# Altium project PCB_Test_Stand_Pergam_v1.PrjPcb
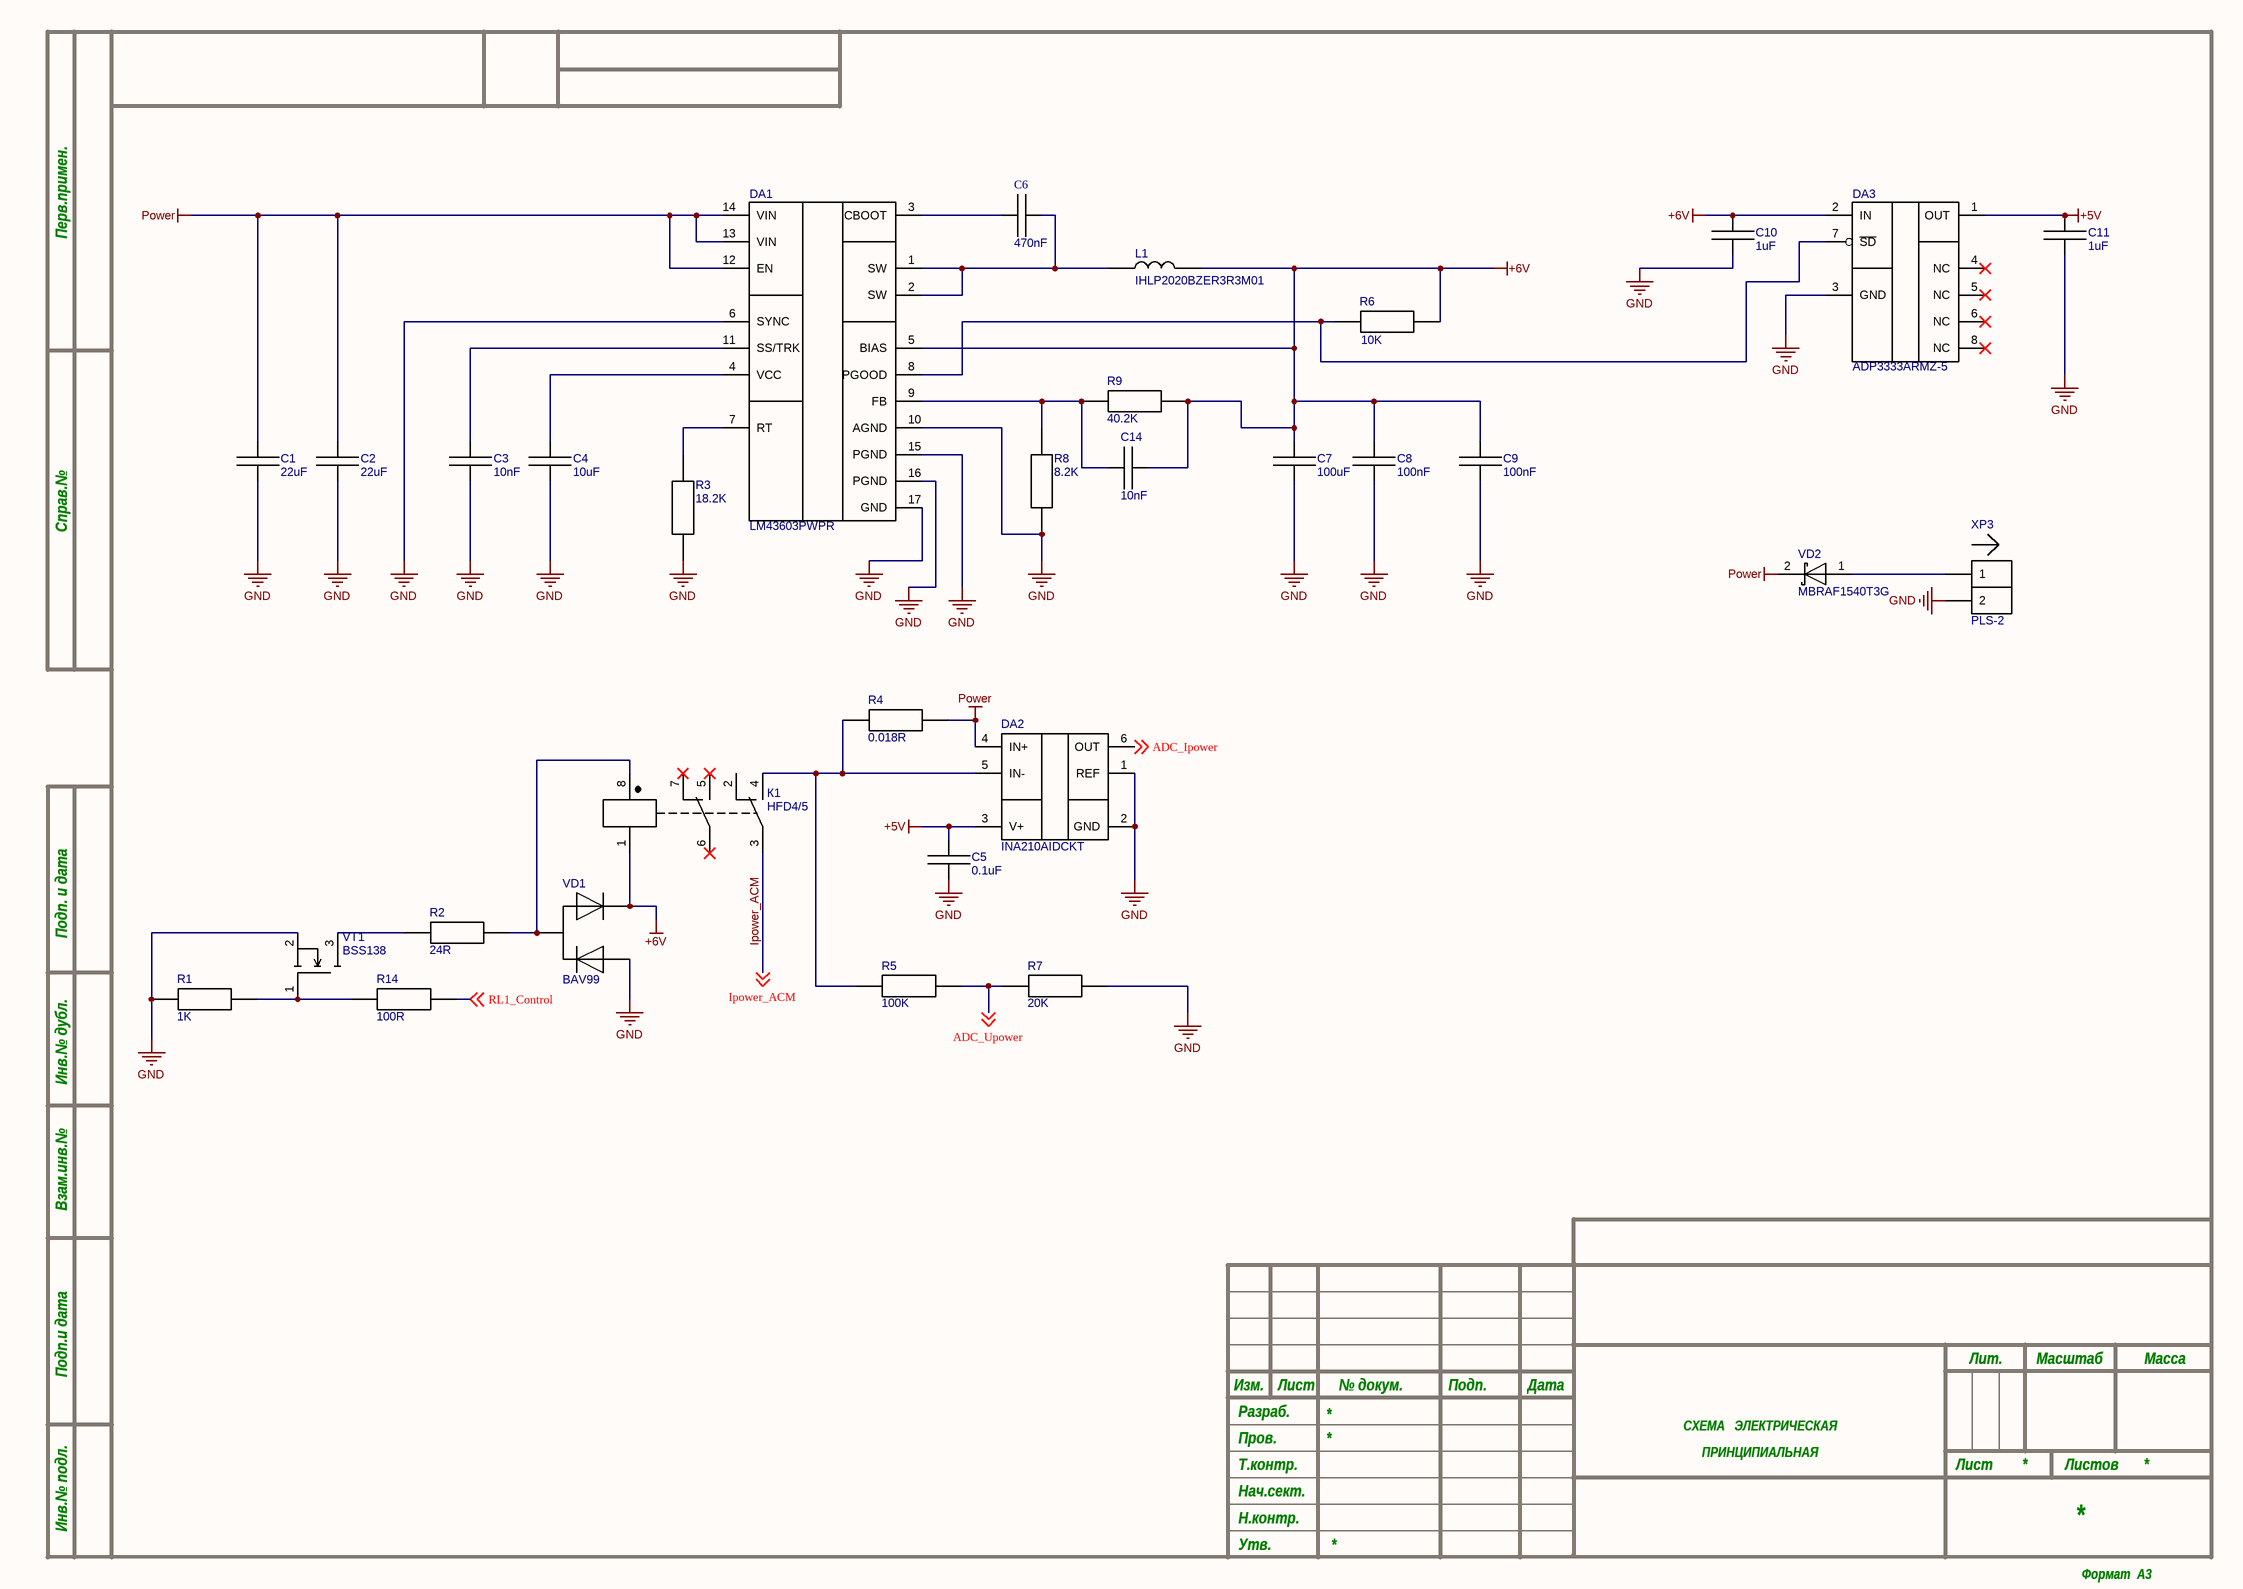
[diagram p0: Power.SchDoc]
8 sheets, 208 parts. Net scope: global (net labels, ports and power ports of the same name join across sheets).
Board file: test_stand.PcbDoc
Sheets:
  Power.SchDoc
  ControlPoint.SchDoc
  Rele.SchDoc
  STM.SchDoc
  Connectors.SchDoc
  Check_Laser.SchDoc
  Peltie.SchDoc
  MUX.SchDoc

## Sheet Power.SchDoc
size 420 x 297 mm

### Parts
C1  22uF  [1210C]
C2  22uF  [1210C]
C3  10nF  [0402C]
C4  10uF  [0402C]
C5  0.1uF  [0603C]
C6  470nF  [0402C]
C7  100uF  [1210C]
C8  100nF  [0402C]
C9  100nF  [0402C]
C10  1uF  [0603C]
C11  1uF  [0603C]
C14  10nF  [0402C]
DA1  LM43603PWPR  [TSSOP-17]
DA2  INA210AIDCKT  [SC-70-6]
DA3  ADP3333ARMZ-5  [MSOP-8]
L1  IHLP2020BZER3R3M01  [IHLP2020CZ-01]
R1  1K  [R0402]
R2  24R  [R0402]
R3  18.2K  [R0402]
R4  0.018R  [R1206]
R5  100K  [R0402]
R6  10K  [R0402]
R7  20K  [R0402]
R8  8.2K  [R0402]
R9  40.2K  [R0402]
R14  100R  [R0402]
VD1  BAV99  [SOT-23-3]
VD2  MBRAF1540T3G  [SMA-FL]
VT1  BSS138  [SOT-23-3]
XP3  PLS-2  [PLS-2]
К1  HFD4/5  [DIP-8]

### Nets
+5V: C5.2 C11.2 DA2.3(V+) DA3.1(OUT)
+6V: C7.2 C8.2 C9.2 C10.2 C14.2 DA1.5(BIAS) DA3.2(IN) L1.2 R6.2 R9.2 VD1.2 К1.1
GND: C1.1 C2.1 C3.1 C4.1 C5.1 C7.1 C8.1 C9.1 C10.1 C11.1 DA1.6(SYNC) DA1.10(AGND) DA1.15(PGND) DA1.16(PGND) DA1.17(GND) DA2.1(REF) DA2.2(GND) DA3.3(GND) R1.1 R3.1 R7.2 R8.1 VD1.1 VT1.2 XP3.2
Power: C1.2 C2.2 DA1.12(EN) DA1.13(VIN) DA1.14(VIN) DA2.4(IN+) R4.1 VD2.2
ADC_Ipower: DA2.6(OUT) ; off-sheet ADC_Ipower
ADC_Upower: R5.2 R7.1 ; off-sheet ADC_Upower
Ipower_ACM: К1.3 ; off-sheet Ipower_ACM
RL1_Control: R14.2 ; off-sheet RL1_Control
NetC3_2: C3.2 DA1.11(SS/TRK)
NetC4_2: C4.2 DA1.4(VCC)
NetC6_1: C6.1 DA1.3(CBOOT)
NetC6_2: C6.2 DA1.1(SW) DA1.2(SW) L1.1
NetC14_1: C14.1 DA1.9(FB) R8.2 R9.1
NetDA1_7: DA1.7(RT) R3.2
NetDA1_8: DA1.8(PGOOD) DA3.7(~{SD}) R6.1
NetDA2_5: DA2.5(IN-) R4.2 R5.1 К1.4
NetR1_2: R1.2 R14.1 VT1.1
NetR2_1: R2.1 VT1.3
NetR2_2: R2.2 VD1.3 К1.8
NetVD2_1: VD2.1 XP3.1

Not connected (* = marked no-connect by the designer): DA3 4(NC)* 5(NC)* 6(NC)* 8(NC)*; К1 2 5* 6* 7*

### Notes on the sheet
- Перв.примен.
- Справ.№
- Подп. и дата
- Инв.№ дубл.
- Взам.инв.№
- Подп.и дата
- Разраб.
- Изм.
- Лист
- № докум.
- Подп.
- Дата
- Лит.
- Масштаб
- Масса
- Т.контр.
- Пров.
- СХЕМА   ЭЛЕКТРИЧЕСКАЯ
- ПРИНЦИПИАЛЬНАЯ
- Листов
- Инв.№ подл.
- Утв.
- Н.контр.
- Нач.сект.
- Формат  A3

### Library data of the parts
C1 C2 = C1210-22uF 10% 50V: Part Number: SMD CAP CER 22uF ±10% 50V X7R 1210; Solder_Amount: 2; Pkg: 1210; MountType: SMD; Mount: MOUNT
C3 C14 = C0402-10nF 10% 50V: Part Number: SMD CAP CER 10nF ±10% 50V X5R 0402; Added_by: Rutel@Mail.ru; Solder_Amount: 2; Pkg: 0402; Created_at: 27/03/2020; MountType: SMD; Mount: MOUNT
C4 = C0402-10UF 10% 10V: Part Number: SMD CAP CER 10UF ±10% 10V X5R 0402; Added_by: Rutel@Mail.ru; Solder_Amount: 2; Pkg: 0402; Created_at: 27/03/2020; MountType: SMD; Mount: MOUNT
C5 = C0603-0.1UF 10% 50V: C0603 0.1UF 10% 50V; Part Number: SMD CAP CER 0.1UF ±10% 50V X7R 0603; Added_by: anton@teslatec.ru; Solder_Amount: 2; Pkg: 0603; Created_at: 10/01/2023; MountType: SMD; Mount: MOUNT
C6 = C0402-470nF 10% 50V: Part Number: SMD CAP CER 470nF ±10% 50V X5R 0402; Solder_Amount: 2; Pkg: 0402; MountType: SMD; Mount: MOUNT
C7 = C1210-100UF 10% 16V: Part Number: SMD CAP CER 100UF ±10% 16V X7R 1210; Solder_Amount: 2; Pkg: 1210; MountType: SMD; Mount: MOUNT
C8 C9 = C0402-100nF 10% 50V: Part Number: SMD CAP CER 100nF ±10% 50V X5R 0402; Added_by: Rutel@Mail.ru; Solder_Amount: 2; Pkg: 0402; Created_at: 27/03/2020; MountType: SMD; Mount: MOUNT
C10 C11 = C0603-1uF 10% 50V: Part Number: SMD CAP CER 1uF ±10% 50V X7R 0603; Added_by: grebelny_av@teslatec.ru; Solder_Amount: 2; Pkg: 0603; Created_at: 22/06/2021; MountType: SMD; Mount: MOUNT
DA1 = LM43603PWPR: LM43603PWPR 3.5-V to 36-V, 3-A Synchronous Step-Down Voltage Converter; Added_by: irdolgopolowa@yandex.ru; Pkg: MSE 16; Solder_Amount: 17; Value: LM43603QWPR; Created_at: 29/10/24; Mount: MOUNT; MountType: SMD; Part Number: LM43603PWPR
DA2 = INA210AIDCKT: 26V, 14kHz, bi-directional, package SC70-6, -40 to 125; Added_by: ridel_av@teslatec.ru; Solder_Amount: 6; Created_at: 02/02/2022; Mount: MOUNT; MountType: SMD; Part Number: INA210AIDCKT; Pkg: SC70-6
DA3 = ADP3333ARMZ-5: 5V 300 mA, Low Dropout, / CMOS Linear Regulator; Added_by: irdolgopolowa@yandex.ru; Pkg: 8-Lead MSOP; Solder_Amount: 8; Created_at: 29/10/24; Mount: MOUNT; MountType: SMD; Part Number: ADP3333ARMZ-5
L1 = IHLP2020BZER3R3M01: FIXED IND 3.3UH 3.3A 79 MOHM SMD; Solder_Amount: 2; Pkg: IHLP-2020BZ-01; Added_by: Rutel@teslatec.ru; Part Number: IHLP2020BZER3R3M01; MountType: SMD; Mount: MOUNT; Created_at: 14/05/2020
R1 = R0402-1K: Resistor SMD 1K 1% 0402; Part Number: SMD RES 1 KOHM 1% ±100ppm/°C 0402; Added_by: irdolgopolowa@yandex.ru; Solder_Amount: 2; Pkg: 0402; Created_at: 29/10/24; MountType: SMD; Mount: MOUNT
R2 = R0402-24R: Resistor SMD 24R 1% 0402; Part Number: SMD RES 24R OHM 1% ±100ppm/°C 0402; Added_by: Rutel@teslatec.ru; Solder_Amount: 2; Pkg: 0402; Created_at: 21/04/2020; MountType: SMD; Mount: MOUNT
R3 = R0402-18.2K: Resistor SMD 18.2K 1% 0402; Part Number: SMD RES 18.2 KOHM 1% ±100ppm/°C 0402; Added_by: Rutel@teslatec.ru; Solder_Amount: 2; Pkg: 0402; Created_at: 21/04/2020; MountType: SMD; Mount: MOUNT
R4 = R1206-0.018R: Resistor SMD 0.018R 1% 1206; Part Number: TL2BR018F SMD RES 0.018 OHM 1% ±75ppm/°C 1206; Added_by: irdolgopolowa@yandex.ru; Solder_Amount: 2; Pkg: 1206; Created_at: 07/11/2024; MountType: SMD; Mount: MOUNT
R5 = R0402-100K: Resistor SMD 100K 1% 0402; Part Number: SMD RES 100 KOHM 1% ±100ppm/°C 0402; Added_by: Rutel@teslatec.ru; Solder_Amount: 2; Pkg: 0402; Created_at: 21/04/2020; MountType: SMD; Mount: MOUNT
R6 = R0402-10K: Resistor SMD 10K 1% 0402; Part Number: SMD RES 10 KOHM 1% ±100ppm/°C 0402; Added_by: Rutel@teslatec.ru; Solder_Amount: 2; Pkg: 0402; Created_at: 21/04/2020; MountType: SMD; Mount: MOUNT
R7 = R0402-20K: Resistor SMD 20K 1% 0402; Part Number: SMD RES 20 KOHM 1% ±100ppm/°C 0402; Added_by: Rutel@teslatec.ru; Solder_Amount: 2; Pkg: 0402; Created_at: 21/04/2020; MountType: SMD; Mount: MOUNT
R8 = R0402-8.2K: Resistor SMD 8.2K 1% 0402; Part Number: SMD RES 8.2 KOHM 1% ±100ppm/°C 0402; Added_by: Rutel@teslatec.ru; Solder_Amount: 2; Pkg: 0402; Created_at: 21/04/2020; MountType: SMD; Mount: MOUNT
R9 = R0402-40.2K: Resistor SMD 40.2K 1% 0402; Part Number: SMD RES 40.2K KOHM 1% ±100ppm/°C 0402; Added_by: ridel_av@teslatec.ru; Solder_Amount: 2; Pkg: 0402; Created_at: 15/12/2021; MountType: SMD; Mount: MOUNT
R14 = R0402-100R: Resistor SMD 100R 1% 0402; Part Number: SMD RES 100 OHM 1% ±100ppm/°C 0402; Added_by: irdolgopolowa@yandex.ru; Solder_Amount: 2; Pkg: 0402; Created_at: 29/10/24; MountType: SMD; Mount: MOUNT
VD1 = BAV99: BAV99, UMW, 70В, 200мА; Added_by: andrew@teslatec.ru; Solder_Amount: 3; Created_at: 29/06/2020; Mount: MOUNT; MountType: SMD; Pkg: SOT-23-3; Part Number: BAV99
VD2 = MBRAF1540T3G: 1.5 A, 40 V Schottky Rectifier; Added_by: irdolgopolowa@yandex.ru; Solder_Amount: 2; Created_at: 29.10.24; Mount: MOUNT; MountType: SMD; Pkg: SMA-FL; Part Number: MBRAF1540T3G
VT1 = BSS138: N-Channel Logic Level Enhancement Mode Field Effect Transistor; Solder_Amount: 3; Added_by: ma_lubushkin@teslatec.ru; Pkg: SOT-23; Part Number: BSS138; Mount: MOUNT; MountType: SMD; Created_at: 03/12/2019
XP3 = PLS-2: HEADER 2.54mm; Added_by: irdolgopolowa@yandex.ru; Solder_Amount: 2; Created_at: 29/10/24; Mount: MOUNT; MountType: THM; Part Number: PLS-2; Pkg: PLS-2
К1 = HFD4/5: HFD4/5 (IM03TS) (1-1462037-8), 5VDC, 2A/250VAC DPDT; Part Number: HFD4/5SR; Added_by: irdolgopolowa@yandex.ru; Solder_Amount: 8; Created_at: 30/10/24; Mount: MOUNT; MountType: THM; Pkg: DIP-8

## Sheet ControlPoint.SchDoc
size 420 x 297 mm
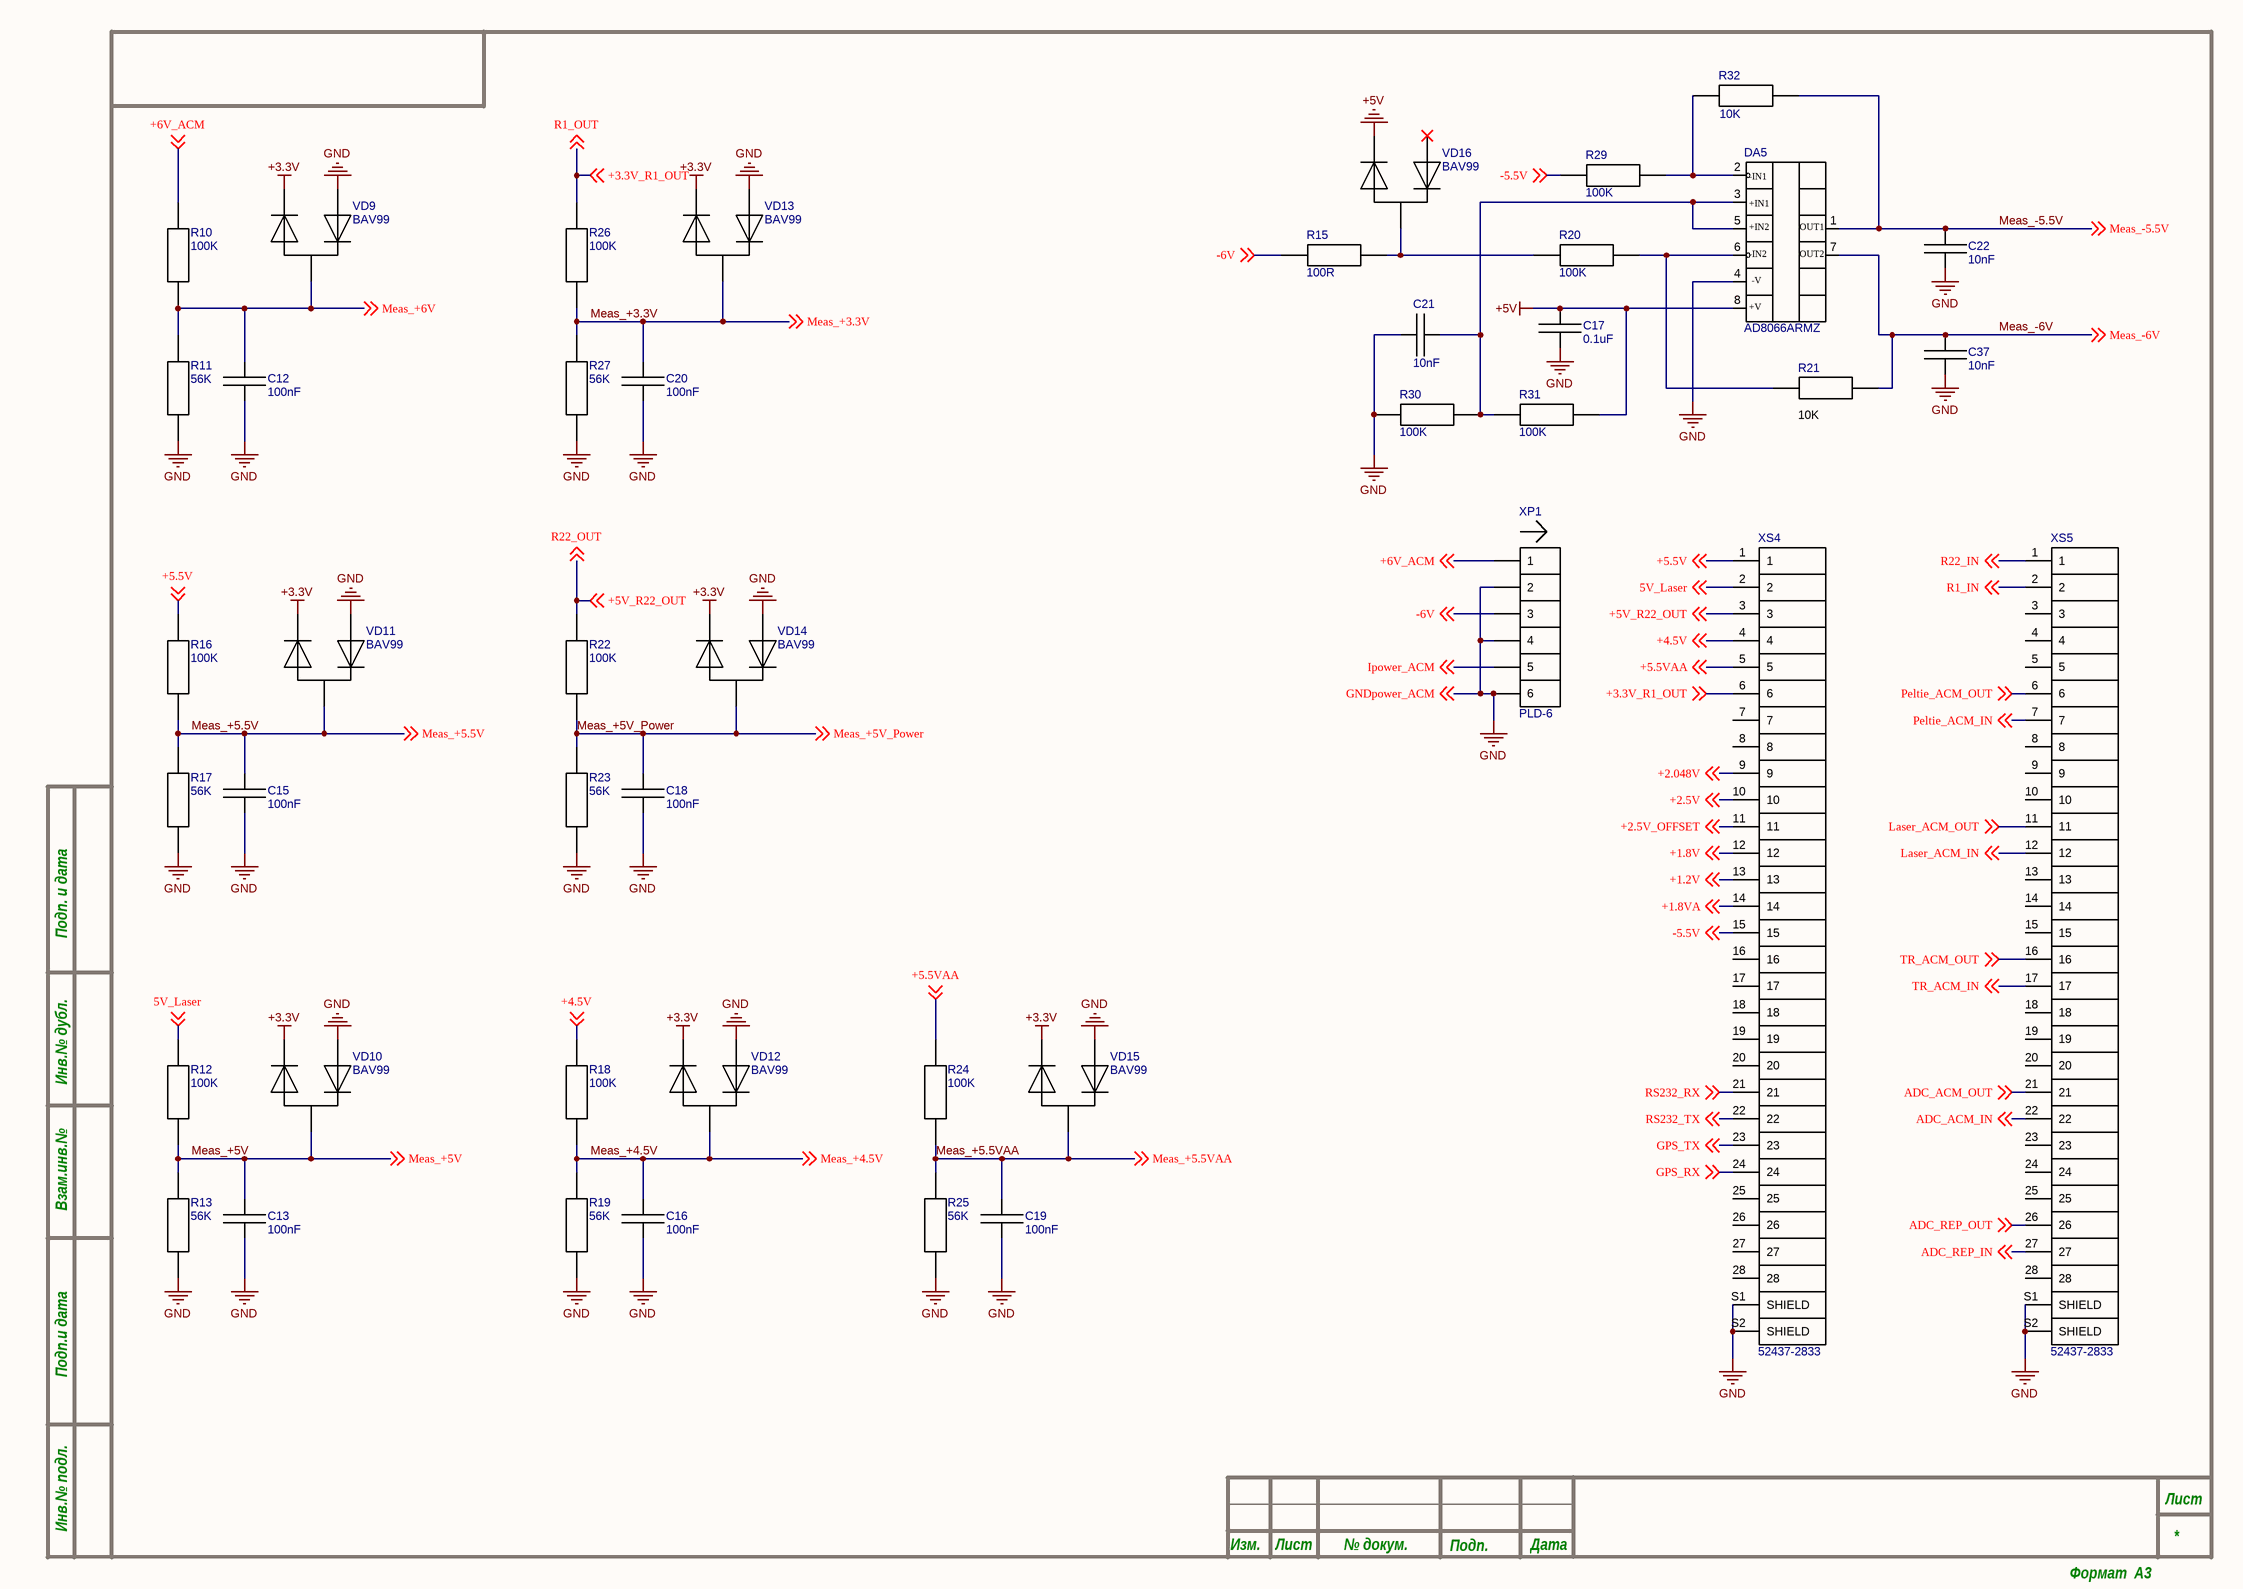
[diagram p1: ControlPoint.SchDoc]

### Parts
C12  100nF  [0402C]
C13  100nF  [0402C]
C15  100nF  [0402C]
C16  100nF  [0402C]
C17  0.1uF  [0603C]
C18  100nF  [0402C]
C19  100nF  [0402C]
C20  100nF  [0402C]
C21  10nF  [0402C]
C22  10nF  [0402C]
C37  10nF  [0402C]
DA5  AD8066ARMZ  [MSOP-8]
R10  100K  [R0402]
R11  56K  [R0402]
R12  100K  [R0402]
R13  56K  [R0402]
R15  100R  [R0402]
R16  100K  [R0402]
R17  56K  [R0402]
R18  100K  [R0402]
R19  56K  [R0402]
R20  100K  [R0402]
R21  10K  [R0402]
R22  100K  [R0402]
R23  56K  [R0402]
R24  100K  [R0402]
R25  56K  [R0402]
R26  100K  [R0402]
R27  56K  [R0402]
R29  100K  [R0402]
R30  100K  [R0402]
R31  100K  [R0402]
R32  10K  [R0402]
VD9  BAV99  [SOT-23-3]
VD10  BAV99  [SOT-23-3]
VD11  BAV99  [SOT-23-3]
VD12  BAV99  [SOT-23-3]
VD13  BAV99  [SOT-23-3]
VD14  BAV99  [SOT-23-3]
VD15  BAV99  [SOT-23-3]
VD16  BAV99  [SOT-23-3]
XP1  PLD-6  [PLD-6]
XS4  52437-2833  [MOLEX_52437-2833]
XS5  52437-2833  [MOLEX_52437-2833]

### Nets
+3.3V: VD9.2 VD10.2 VD11.2 VD12.2 VD13.2 VD14.2 VD15.2
+5V: C17.1 DA5.8(+VS) R31.2 VD16.2
GND: C12.1 C13.1 C15.1 C16.1 C17.2 C18.1 C19.1 C20.1 C21.1 C22.1 C37.1 DA5.4(-VS) R11.2 R13.2 R17.2 R19.2 R23.2 R25.2 R27.2 R30.1 VD9.1 VD10.1 VD11.1 VD12.1 VD13.1 VD14.1 VD15.1 XP1.2 XP1.4 XP1.6 XS4.S1(SHIELD) XS4.S2(SHIELD) XS5.S1(SHIELD) XS5.S2(SHIELD) ; off-sheet GNDpower_ACM  [also labelled GNDpower_ACM]
5V_Laser: R12.1 XS4.2 ; off-sheet 5V_Laser
+1.2V: XS4.13 ; off-sheet +1.2V
+1.8V: XS4.12 ; off-sheet +1.8V
+1.8VA: XS4.14 ; off-sheet +1.8VA
+2.5V: XS4.10 ; off-sheet +2.5V
+2.5V_OFFSET: XS4.11 ; off-sheet +2.5V_OFFSET
+2.048V: XS4.9 ; off-sheet +2.048V
+4.5V: R18.1 XS4.4 ; off-sheet +4.5V
+5.5V: R16.1 XS4.1 ; off-sheet +5.5V
+5.5VAA: R24.1 XS4.5 ; off-sheet +5.5VAA
+6V_ACM: R10.1 XP1.1 ; off-sheet +6V_ACM
-5.5V: R29.1 XS4.15 ; off-sheet -5.5V
-6V: R15.1 XP1.3 ; off-sheet -6V
ADC_ACM_IN: XS5.22 ; off-sheet ADC_ACM_IN
ADC_ACM_OUT: XS5.21 ; off-sheet ADC_ACM_OUT
ADC_REP_IN: XS5.27 ; off-sheet ADC_REP_IN
ADC_REP_OUT: XS5.26 ; off-sheet ADC_REP_OUT
GPS_RX: XS4.24 ; off-sheet GPS_RX
GPS_TX: XS4.23 ; off-sheet GPS_TX
Ipower_ACM: XP1.5 ; off-sheet Ipower_ACM
Laser_ACM_IN: XS5.12 ; off-sheet Laser_ACM_IN
Laser_ACM_OUT: XS5.11 ; off-sheet Laser_ACM_OUT
Meas_+3.3V: C20.2 R26.2 R27.1 VD13.3 ; off-sheet Meas_+3.3V
Meas_+4.5V: C16.2 R18.2 R19.1 VD12.3 ; off-sheet Meas_+4.5V
Meas_+5.5V: C15.2 R16.2 R17.1 VD11.3 ; off-sheet Meas_+5.5V
Meas_+5.5VAA: C19.2 R24.2 R25.1 VD15.3 ; off-sheet Meas_+5.5VAA
Meas_+5V: C13.2 R12.2 R13.1 VD10.3 ; off-sheet Meas_+5V
Meas_+5V_Power: C18.2 R22.2 R23.1 VD14.3 ; off-sheet Meas_+5V_Power
Meas_+6V: C12.2 R10.2 R11.1 VD9.3 ; off-sheet Meas_+6V
Meas_-5.5V: C22.2 DA5.1(VOUT) R32.2 ; off-sheet Meas_-5.5V
Meas_-6V: C37.2 DA5.7(VOUT2) R21.2 ; off-sheet Meas_-6V
Peltie_ACM_IN: XS5.7 ; off-sheet Peltie_ACM_IN
Peltie_ACM_OUT: XS5.6 ; off-sheet Peltie_ACM_OUT
R1_IN: XS5.2 ; off-sheet R1_IN
R1_OUT: R26.1 XS4.6 ; off-sheet R1_OUT, off-sheet +3.3V_R1_OUT  [also labelled +3.3V_R1_OUT]
R22_IN: XS5.1 ; off-sheet R22_IN
R22_OUT: R22.1 XS4.3 ; off-sheet R22_OUT, off-sheet +5V_R22_OUT  [also labelled +5V_R22_OUT]
RS232_RX: XS4.21 ; off-sheet RS232_RX
RS232_TX: XS4.22 ; off-sheet RS232_TX
TR_ACM_IN: XS5.17 ; off-sheet TR_ACM_IN
TR_ACM_OUT: XS5.16 ; off-sheet TR_ACM_OUT
NetC21_2: C21.2 DA5.3(+IN1) DA5.5(+IN2) R30.2 R31.1
NetDA5_2: DA5.2(-IN1) R29.2 R32.1
NetDA5_6: DA5.6(-IN2) R20.2 R21.1
NetR15_2: R15.2 R20.1 VD16.3

Not connected (* = marked no-connect by the designer): VD16 1*; XS4 7 8 16 17 18 19 20 25 26 27 28; XS5 3 4 5 8 9 10 13 14 15 18 19 20 23 24 25 28

### Notes on the sheet
- Подп. и дата
- Инв.№ дубл.
- Взам.инв.№
- Подп.и дата
- Инв.№ подл.
- Изм.
- Лист
- № докум.
- Подп.
- Дата
- Формат  A3
- (in symbol AD8066ARMZ) OUT1; OUT2; -V; +V

### Library data of the parts
C12 C13 C15 C16 C18-C20 = C0402-100nF 10% 50V: as C8 on sheet Power; Created_at: 27/03/2020; MountType: SMD; Mount: MOUNT
C17 = C0603-0.1UF 10% 50V: as C5 on sheet Power; Created_at: 10/01/2023; MountType: SMD; Mount: MOUNT
C21 C22 C37 = C0402-10nF 10% 50V: as C3 on sheet Power; Created_at: 27/03/2020; MountType: SMD; Mount: MOUNT
DA5 = AD8066ARMZ: High Performance, 145 MHz FastFET Op Amps; Added_by: irdolgopolowa@yandex.ru; Solder_Amount: 8; Created_at: 29/10/24; Mount: MOUNT; MountType: SMD; Pkg: MSOP-8; Part Number: AD8066ARMZ
R10 R12 R16 R18 R20 R22 R24 R26 R29-R31 = R0402-100K: as R5 on sheet Power; Created_at: 21/04/2020; MountType: SMD; Mount: MOUNT
R11 R13 R17 R19 R23 R25 R27 = R0402-56K: Resistor SMD 56K 1% 0402; Part Number: SMD RES 56K KOHM 1% ±100ppm/°C 0402; Added_by: ridel_av@teslatec.ru; Solder_Amount: 2; Pkg: 0402; Created_at: 15/12/2021; MountType: SMD; Mount: MOUNT
R15 = R0402-100R: as R14 on sheet Power; Created_at: 29/10/24; MountType: SMD; Mount: MOUNT
R21 R32 = R0402-10K: as R6 on sheet Power; Created_at: 21/04/2020; MountType: SMD; Mount: MOUNT
VD9-VD16 = BAV99: as VD1 on sheet Power; Created_at: 29/06/2020; Mount: MOUNT; MountType: SMD; Pkg: SOT-23-3; Part Number: BAV99
XP1 = PLD-6: Pin Header Pitch 2.54mm; Part Number: PLD-6 (DS1021-2x3); Pkg: PLD-6 2.54mm; Solder_Amount: 6; Added_by: ponomarev_ke@teslatec.ru; MountType: THM; Mount: MOUNT; Mating Part: *; Mating Terminals: *; Cable/Wire: *; Created_at: 21/05/2019
XS4 XS5 = 52437-2833: 28 Position FFC, FPC Connector Contacts, Bottom 0.020 _0.50mm_ Surface Mount, Right Angle; Part Number: 52437-2833 (MOLEX); Mating Part: FFCA 28pin, 0.5mm pitch, AVM 20624 80C 60V VW-1; Solder_Amount: 30; Added_by: ridel_av@teslatec.ru; Mount: MOUNT; MountType: SMD; Pkg: 52437-2833

## Sheet Rele.SchDoc
size 420 x 297 mm
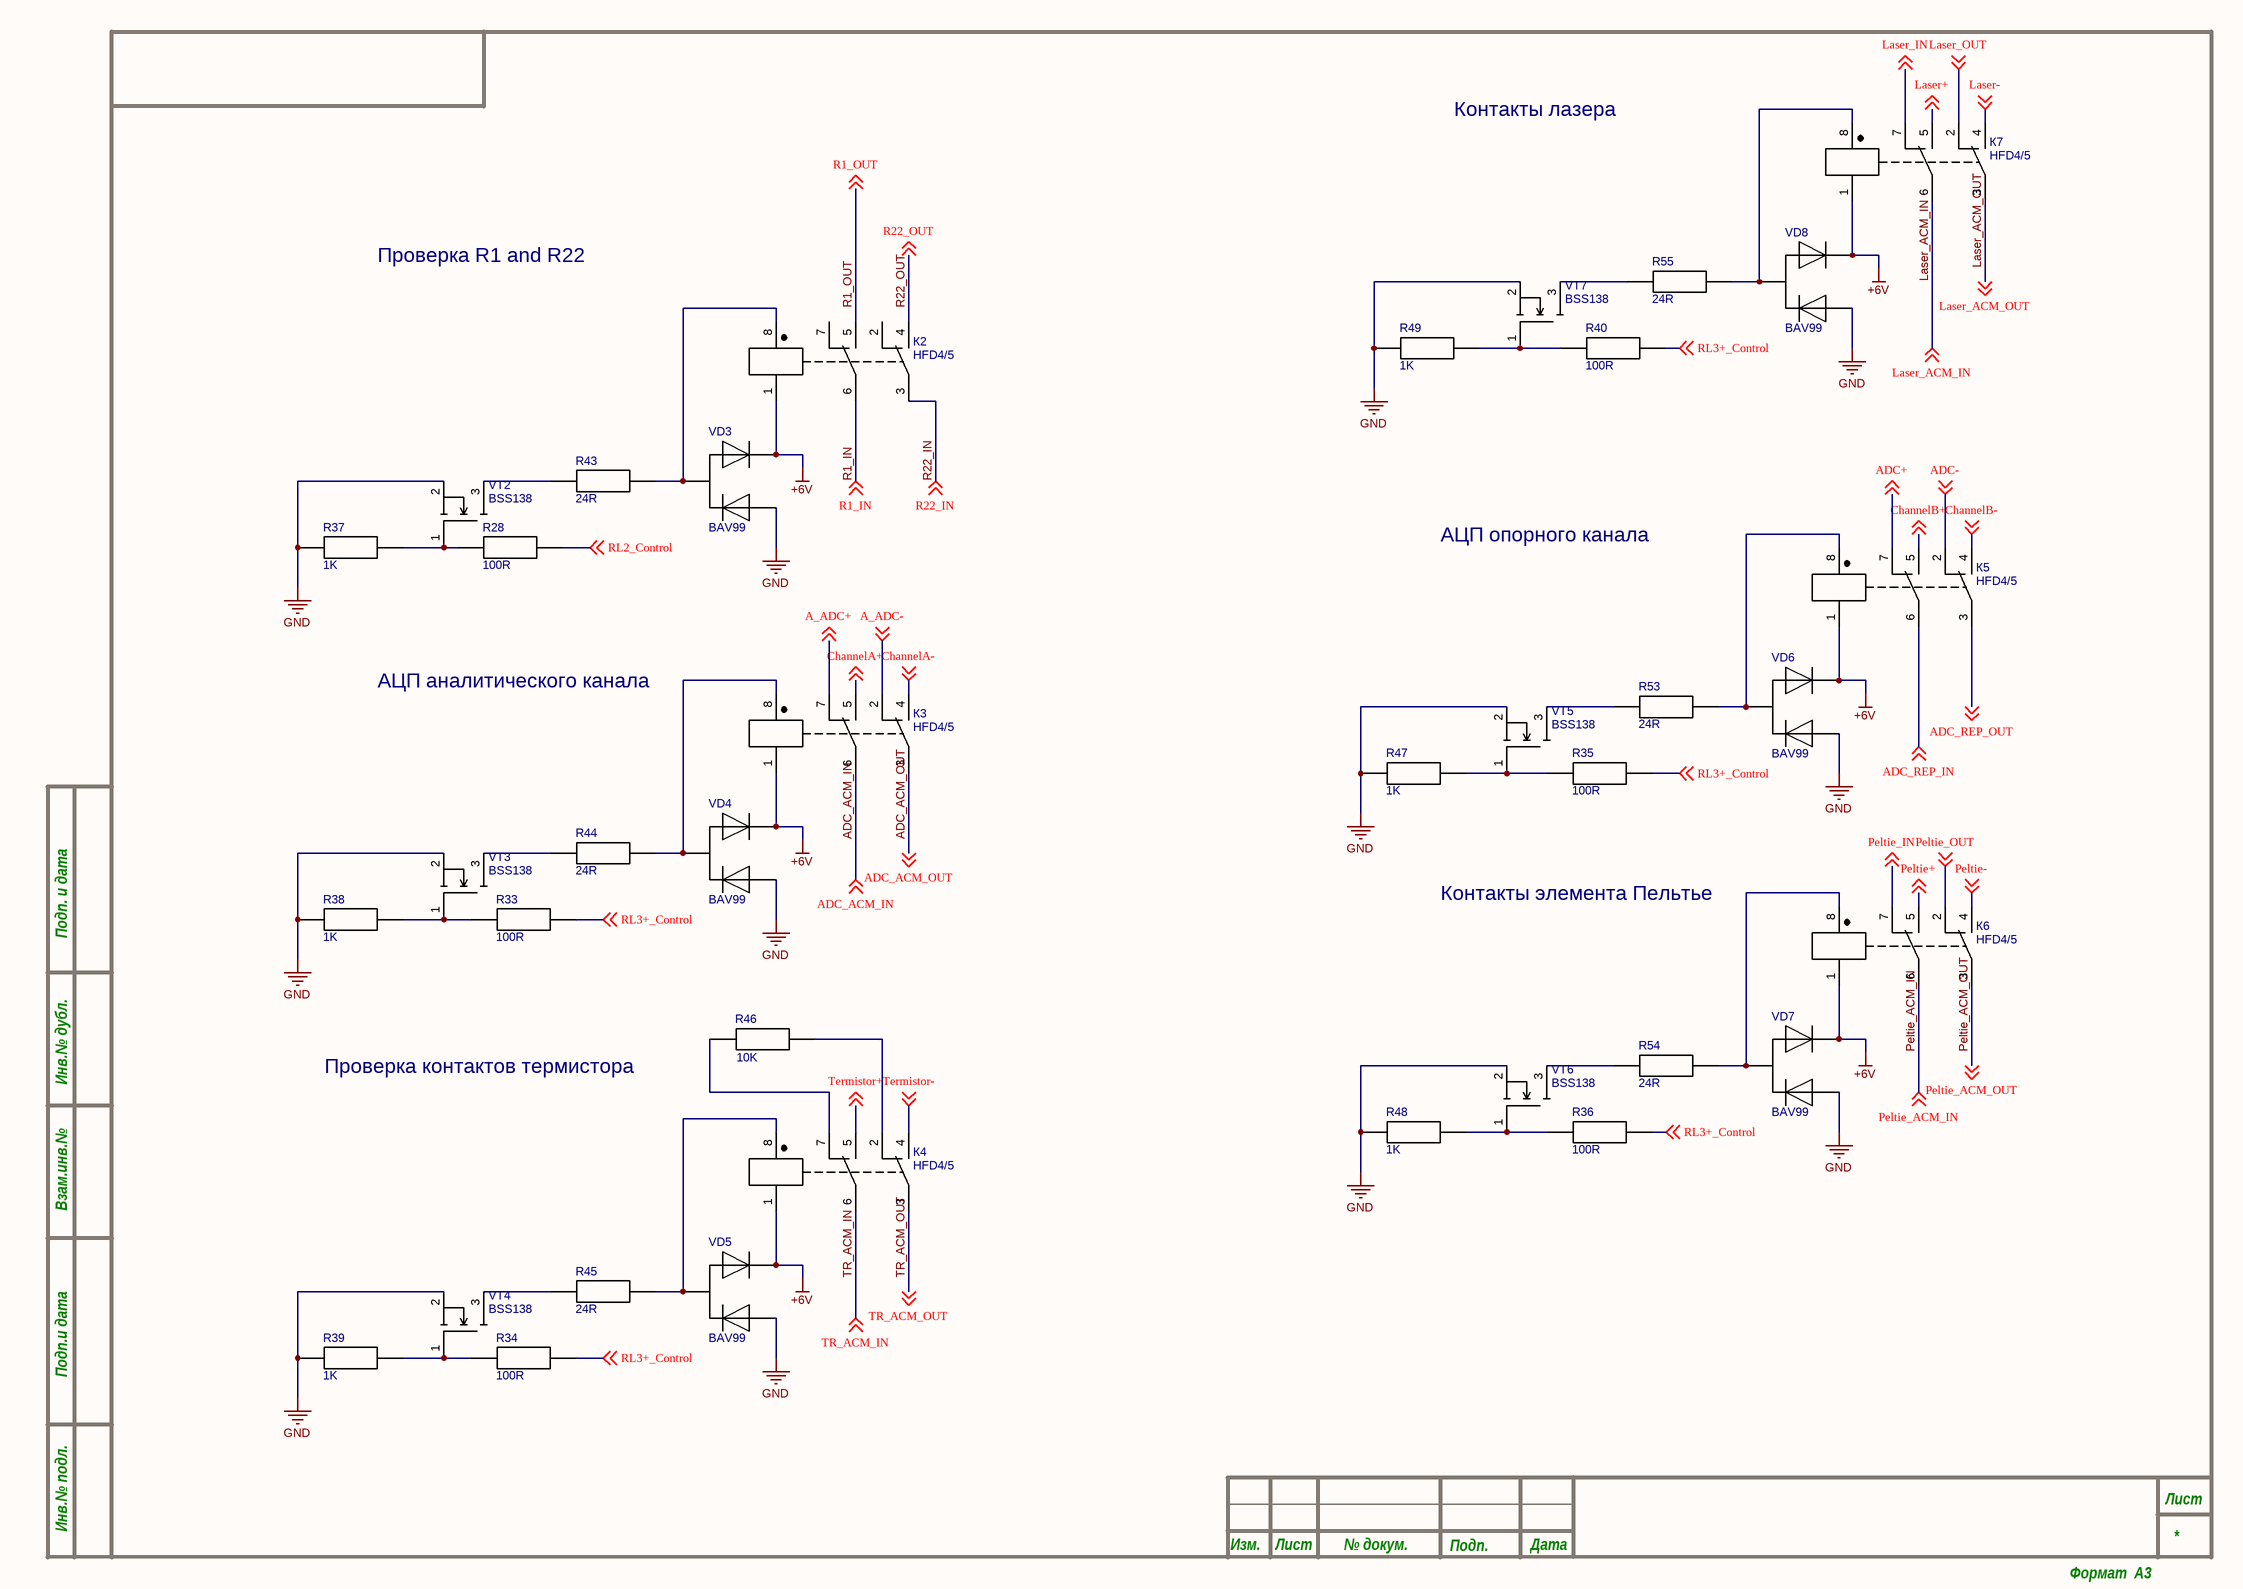
[diagram p2: Rele.SchDoc]

### Parts
R28  100R  [R0402]
R33  100R  [R0402]
R34  100R  [R0402]
R35  100R  [R0402]
R36  100R  [R0402]
R37  1K  [R0402]
R38  1K  [R0402]
R39  1K  [R0402]
R40  100R  [R0402]
R43  24R  [R0402]
R44  24R  [R0402]
R45  24R  [R0402]
R46  10K  [R0402]
R47  1K  [R0402]
R48  1K  [R0402]
R49  1K  [R0402]
R53  24R  [R0402]
R54  24R  [R0402]
R55  24R  [R0402]
VD3  BAV99  [SOT-23-3]
VD4  BAV99  [SOT-23-3]
VD5  BAV99  [SOT-23-3]
VD6  BAV99  [SOT-23-3]
VD7  BAV99  [SOT-23-3]
VD8  BAV99  [SOT-23-3]
VT2  BSS138  [SOT-23-3]
VT3  BSS138  [SOT-23-3]
VT4  BSS138  [SOT-23-3]
VT5  BSS138  [SOT-23-3]
VT6  BSS138  [SOT-23-3]
VT7  BSS138  [SOT-23-3]
К2  HFD4/5  [DIP-8]
К3  HFD4/5  [DIP-8]
К4  HFD4/5  [DIP-8]
К5  HFD4/5  [DIP-8]
К6  HFD4/5  [DIP-8]
К7  HFD4/5  [DIP-8]

### Nets
+6V: VD3.2 VD4.2 VD5.2 VD6.2 VD7.2 VD8.2 К2.1 К3.1 К4.1 К5.1 К6.1 К7.1
GND: R37.1 R38.1 R39.1 R47.1 R48.1 R49.1 VD3.1 VD4.1 VD5.1 VD6.1 VD7.1 VD8.1 VT2.2 VT3.2 VT4.2 VT5.2 VT6.2 VT7.2
A_ADC+: К3.7 ; off-sheet A_ADC+
A_ADC-: К3.2 ; off-sheet A_ADC-
ADC+: К5.7 ; off-sheet ADC+
ADC-: К5.2 ; off-sheet ADC-
ADC_ACM_IN: К3.6 ; off-sheet ADC_ACM_IN
ADC_ACM_OUT: К3.3 ; off-sheet ADC_ACM_OUT
ADC_REP_IN: К5.6 ; off-sheet ADC_REP_IN
ADC_REP_OUT: К5.3 ; off-sheet ADC_REP_OUT
ChannelA+: К3.5 ; off-sheet ChannelA+
ChannelA-: К3.4 ; off-sheet ChannelA-
ChannelB+: К5.5 ; off-sheet ChannelB+
ChannelB-: К5.4 ; off-sheet ChannelB-
Laser+: К7.5 ; off-sheet Laser+
Laser-: К7.4 ; off-sheet Laser-
Laser_ACM_IN: К7.6 ; off-sheet Laser_ACM_IN
Laser_ACM_OUT: К7.3 ; off-sheet Laser_ACM_OUT
Laser_IN: К7.7 ; off-sheet Laser_IN
Laser_OUT: К7.2 ; off-sheet Laser_OUT
Peltie+: К6.5 ; off-sheet Peltie+
Peltie-: К6.4 ; off-sheet Peltie-
Peltie_ACM_IN: К6.6 ; off-sheet Peltie_ACM_IN
Peltie_ACM_OUT: К6.3 ; off-sheet Peltie_ACM_OUT
Peltie_IN: К6.7 ; off-sheet Peltie_IN
Peltie_OUT: К6.2 ; off-sheet Peltie_OUT
R1_IN: К2.6 ; off-sheet R1_IN
R1_OUT: К2.5 ; off-sheet R1_OUT
R22_IN: К2.3 ; off-sheet R22_IN
R22_OUT: К2.4 ; off-sheet R22_OUT
RL2_Control: R28.2 ; off-sheet RL2_Control
RL3+_Control: R33.2 R34.2 R35.2 R36.2 R40.2 ; off-sheet RL3+_Control
Termistor+: К4.5 ; off-sheet Termistor+
Termistor-: К4.4 ; off-sheet Termistor-
TR_ACM_IN: К4.6 ; off-sheet TR_ACM_IN
TR_ACM_OUT: К4.3 ; off-sheet TR_ACM_OUT
NetR28_1: R28.1 R37.2 VT2.1
NetR33_1: R33.1 R38.2 VT3.1
NetR34_1: R34.1 R39.2 VT4.1
NetR35_1: R35.1 R47.2 VT5.1
NetR36_1: R36.1 R48.2 VT6.1
NetR40_1: R40.1 R49.2 VT7.1
NetR43_1: R43.1 VT2.3
NetR43_2: R43.2 VD3.3 К2.8
NetR44_1: R44.1 VT3.3
NetR44_2: R44.2 VD4.3 К3.8
NetR45_1: R45.1 VT4.3
NetR45_2: R45.2 VD5.3 К4.8
NetR46_1: R46.1 К4.7
NetR46_2: R46.2 К4.2
NetR53_1: R53.1 VT5.3
NetR53_2: R53.2 VD6.3 К5.8
NetR54_1: R54.1 VT6.3
NetR54_2: R54.2 VD7.3 К6.8
NetR55_1: R55.1 VT7.3
NetR55_2: R55.2 VD8.3 К7.8

Not connected (* = marked no-connect by the designer): К2 2 7

### Notes on the sheet
- Контакты лазера
- Проверка R1 and R22
- АЦП опорного канала
- АЦП аналитического канала
- Контакты элемента Пельтье
- Проверка контактов термистора
- Подп. и дата
- Инв.№ дубл.
- Взам.инв.№
- Подп.и дата
- Инв.№ подл.
- Изм.
- Лист
- № докум.
- Подп.
- Дата
- Формат  A3

### Library data of the parts
R28 R33-R36 R40 = R0402-100R: as R14 on sheet Power; Created_at: 29/10/24; MountType: SMD; Mount: MOUNT
R37-R39 R47-R49 = R0402-1K: as R1 on sheet Power; Created_at: 29/10/24; MountType: SMD; Mount: MOUNT
R43-R45 R53-R55 = R0402-24R: as R2 on sheet Power; Created_at: 21/04/2020; MountType: SMD; Mount: MOUNT
R46 = R0402-10K: as R6 on sheet Power; Created_at: 21/04/2020; MountType: SMD; Mount: MOUNT
VD3-VD8 = BAV99: as VD1 on sheet Power; Created_at: 29/06/2020; Mount: MOUNT; MountType: SMD; Pkg: SOT-23-3; Part Number: BAV99
VT2-VT7 = BSS138: as VT1 on sheet Power; Part Number: BSS138; Mount: MOUNT; MountType: SMD; Created_at: 03/12/2019
К2-К7 = HFD4/5: as К1 on sheet Power; Created_at: 30/10/24; Mount: MOUNT; MountType: THM; Pkg: DIP-8

## Sheet STM.SchDoc
size 420 x 297 mm
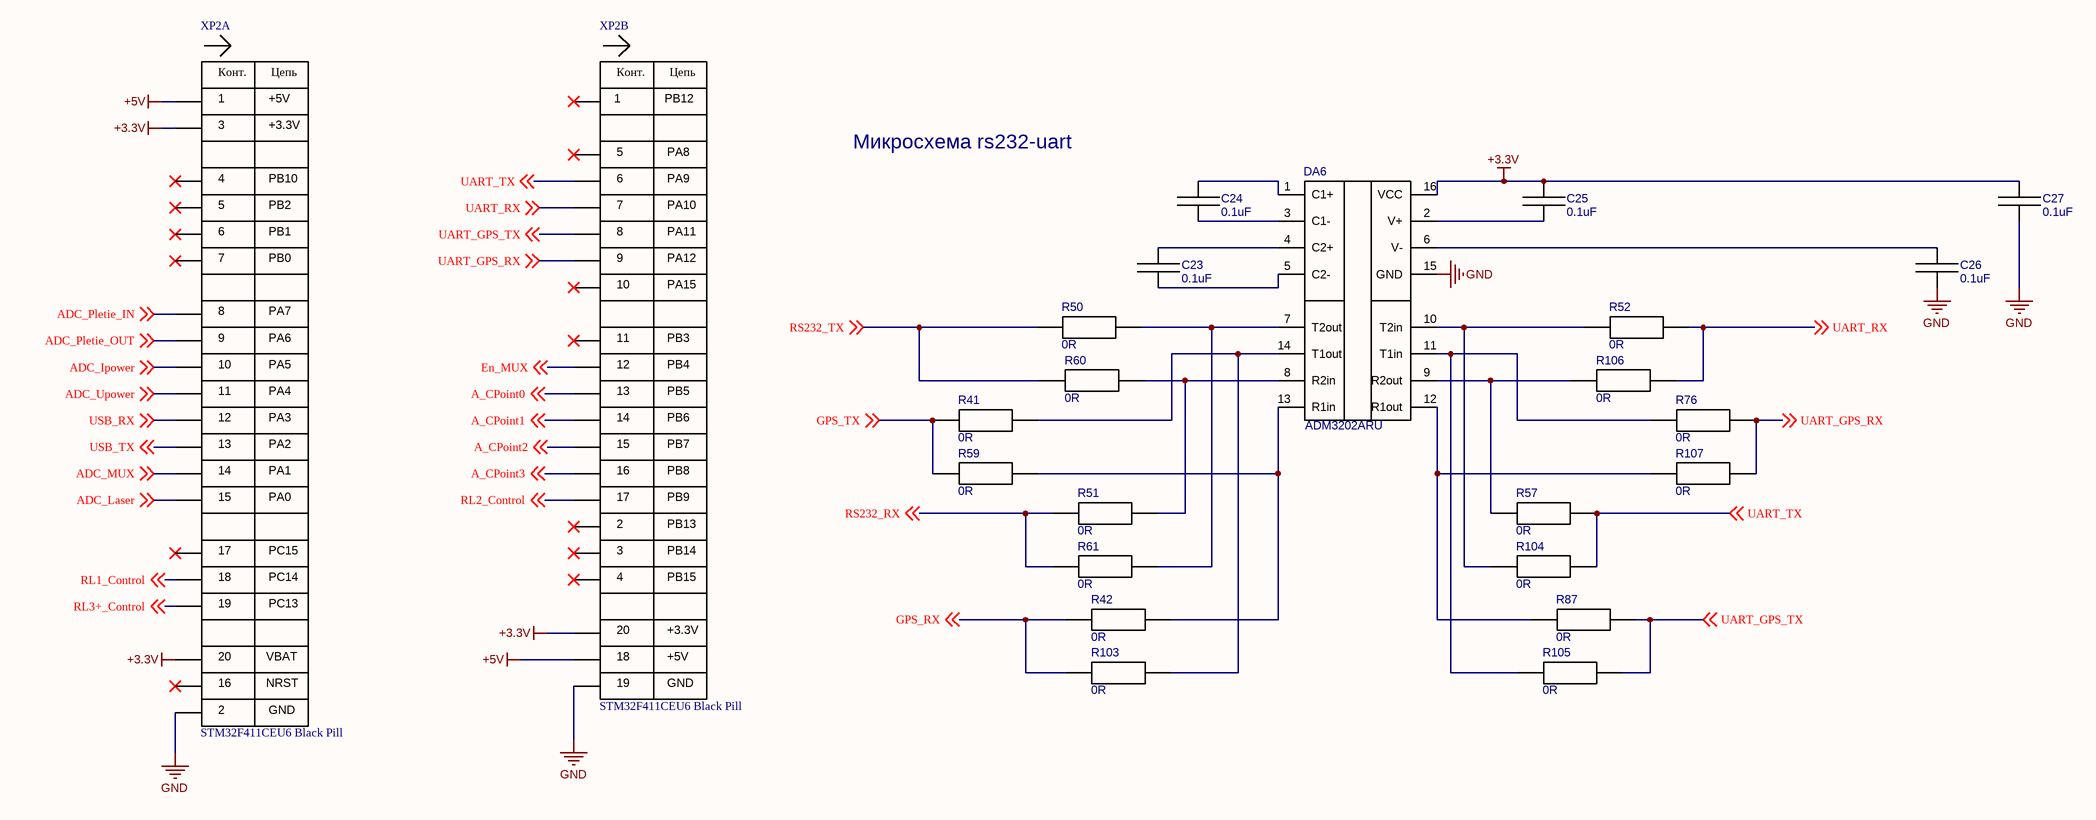
[diagram p3: STM.SchDoc]

### Parts
C23  0.1uF  [0603C]
C24  0.1uF  [0603C]
C25  0.1uF  [0603C]
C26  0.1uF  [0603C]
C27  0.1uF  [0603C]
DA6  ADM3202ARU  [TSSOP-16]
R41  0R  [R0402]
R42  0R  [R0402]
R50  0R  [R0402]
R51  0R  [R0402]
R52  0R  [R0402]
R57  0R  [R0402]
R59  0R  [R0402]
R60  0R  [R0402]
R61  0R  [R0402]
R76  0R  [R0402]
R87  0R  [R0402]
R103  0R  [R0402]
R104  0R  [R0402]
R105  0R  [R0402]
R106  0R  [R0402]
R107  0R  [R0402]
XP2  STM32F411CEU6 Black Pill  [Black pill STM32F411CEU6]  (parts A,B of 2)

### Nets
+3.3V: C25.2 C27.2 DA6.16(VCC) XP2.3(+3.3V) XP2.20(VBAT) XP2.40(+3.3V)
+5V: XP2.1(+5V) XP2.38(+5V)
GND: C26.1 C27.1 DA6.15(GND) XP2.2(GND) XP2.39(GND)
A_CPoint0: XP2.33(PB5) ; off-sheet A_CPoint0
A_CPoint1: XP2.34(PB6) ; off-sheet A_CPoint1
A_CPoint2: XP2.35(PB7) ; off-sheet A_CPoint2
A_CPoint3: XP2.36(PB8) ; off-sheet A_CPoint3
ADC_Ipower: XP2.10(PA5) ; off-sheet ADC_Ipower
ADC_Laser: XP2.15(PA0) ; off-sheet ADC_Laser
ADC_MUX: XP2.14(PA1) ; off-sheet ADC_MUX
ADC_Pletie_IN: XP2.8(PA7) ; off-sheet ADC_Pletie_IN
ADC_Pletie_OUT: XP2.9(PA6) ; off-sheet ADC_Pletie_OUT
ADC_Upower: XP2.11(PA4) ; off-sheet ADC_Upower
En_MUX: XP2.32(PB4) ; off-sheet En_MUX
GPS_RX: R42.1 R103.1 ; off-sheet GPS_RX
GPS_TX: R41.1 R59.1 ; off-sheet GPS_TX
RL1_Control: XP2.18(PC14) ; off-sheet RL1_Control
RL2_Control: XP2.37(PB9) ; off-sheet RL2_Control
RL3+_Control: XP2.19(PC13) ; off-sheet RL3+_Control
RS232_RX: R51.1 R61.1 ; off-sheet RS232_RX
RS232_TX: R50.1 R60.1 ; off-sheet RS232_TX
UART_GPS_RX: R76.2 R107.2 XP2.29(PA12) ; off-sheet UART_GPS_RX
UART_GPS_TX: R87.2 R105.2 XP2.28(PA11) ; off-sheet UART_GPS_TX
UART_RX: R52.2 R106.2 XP2.27(PA10) ; off-sheet UART_RX
UART_TX: R57.2 R104.2 XP2.26(PA9) ; off-sheet UART_TX
USB_RX: XP2.12(PA3) ; off-sheet USB_RX
USB_TX: XP2.13(PA2) ; off-sheet USB_TX
NetC23_1: C23.1 DA6.5(C2-)
NetC23_2: C23.2 DA6.4(C2+)
NetC24_1: C24.1 DA6.3(C1-)
NetC24_2: C24.2 DA6.1(C1+)
NetC25_1: C25.1 DA6.2(V+)
NetC26_2: C26.2 DA6.6(V-)
NetDA6_7: DA6.7(T2out) R50.2 R61.2
NetDA6_8: DA6.8(R2in) R51.2 R60.2
NetDA6_9: DA6.9(R2out) R57.1 R106.1
NetDA6_10: DA6.10(T2in) R52.1 R104.1
NetDA6_11: DA6.11(T1in) R76.1 R105.1
NetDA6_12: DA6.12(R1out) R87.1 R107.1
NetDA6_13: DA6.13(R1in) R42.2 R59.2
NetDA6_14: DA6.14(T1out) R41.2 R103.2

Not connected (* = marked no-connect by the designer): XP2 4(PB10)* 5(PB2)* 6(PB1)* 7(PB0)* 16(NRST)* 17(PC15)* 21(PB12)* 22(PB13)* 23(PB14)* 24(PB15)* 25(PA8)* 30(PA15)* 31(PB3)*

### Notes on the sheet
- Микросхема rs232-uart
- Подп. и дата
- Инв.№ дубл.
- Взам.инв.№
- Подп.и дата
- Инв.№ подл.
- Изм.
- Лист
- № докум.
- Подп.
- Дата
- Формат  A3
- (in symbol STM32F411CEU6 Black pil, part A) Конт.; Цепь
- (in symbol STM32F411CEU6 Black pil, part B) Конт.; Цепь
- (in symbol ADM3202ARU) X/Y

### Library data of the parts
C23-C27 = C0603-0.1UF 10% 50V: as C5 on sheet Power; Created_at: 10/01/2023; MountType: SMD; Mount: MOUNT
DA6 = ADM3202ARU: Low Power, 3.3 V, RS-232 / Line Drivers/Receivers; Added_by: irdolgopolowa@yandex.ru; Solder_Amount: 16; Created_at: 29/10/24; Mount: MOUNT; MountType: SMD; Part Number: ADM3202ARU; Pkg: TSSOP-16
R41 R42 R50-R52 R57 R59-R61 R76 R87 R103-R107 = R0402-0R: Resistor SMD 0R 1% 0402; Part Number: SMD RES 0R 0402; Added_by: irdolgopolowa@yandex.ru; Solder_Amount: 2; Pkg: 0402; Created_at: 29/10/24; MountType: SMD; Mount: MOUNT
XP2 = STM32F411CEU6 Black pil: Mating Part: 2*DS1021-1*20SF11-B; Added_by: irdolgopolowa@yandex.ru; Solder_Amount: 20; Created_at: 29/10/24; Mount: MOUNT; MountType: THM; Pkg: Black pil; Part Number: STM32F411CEU6 Black Pill

## Sheet Connectors.SchDoc
size 420 x 297 mm
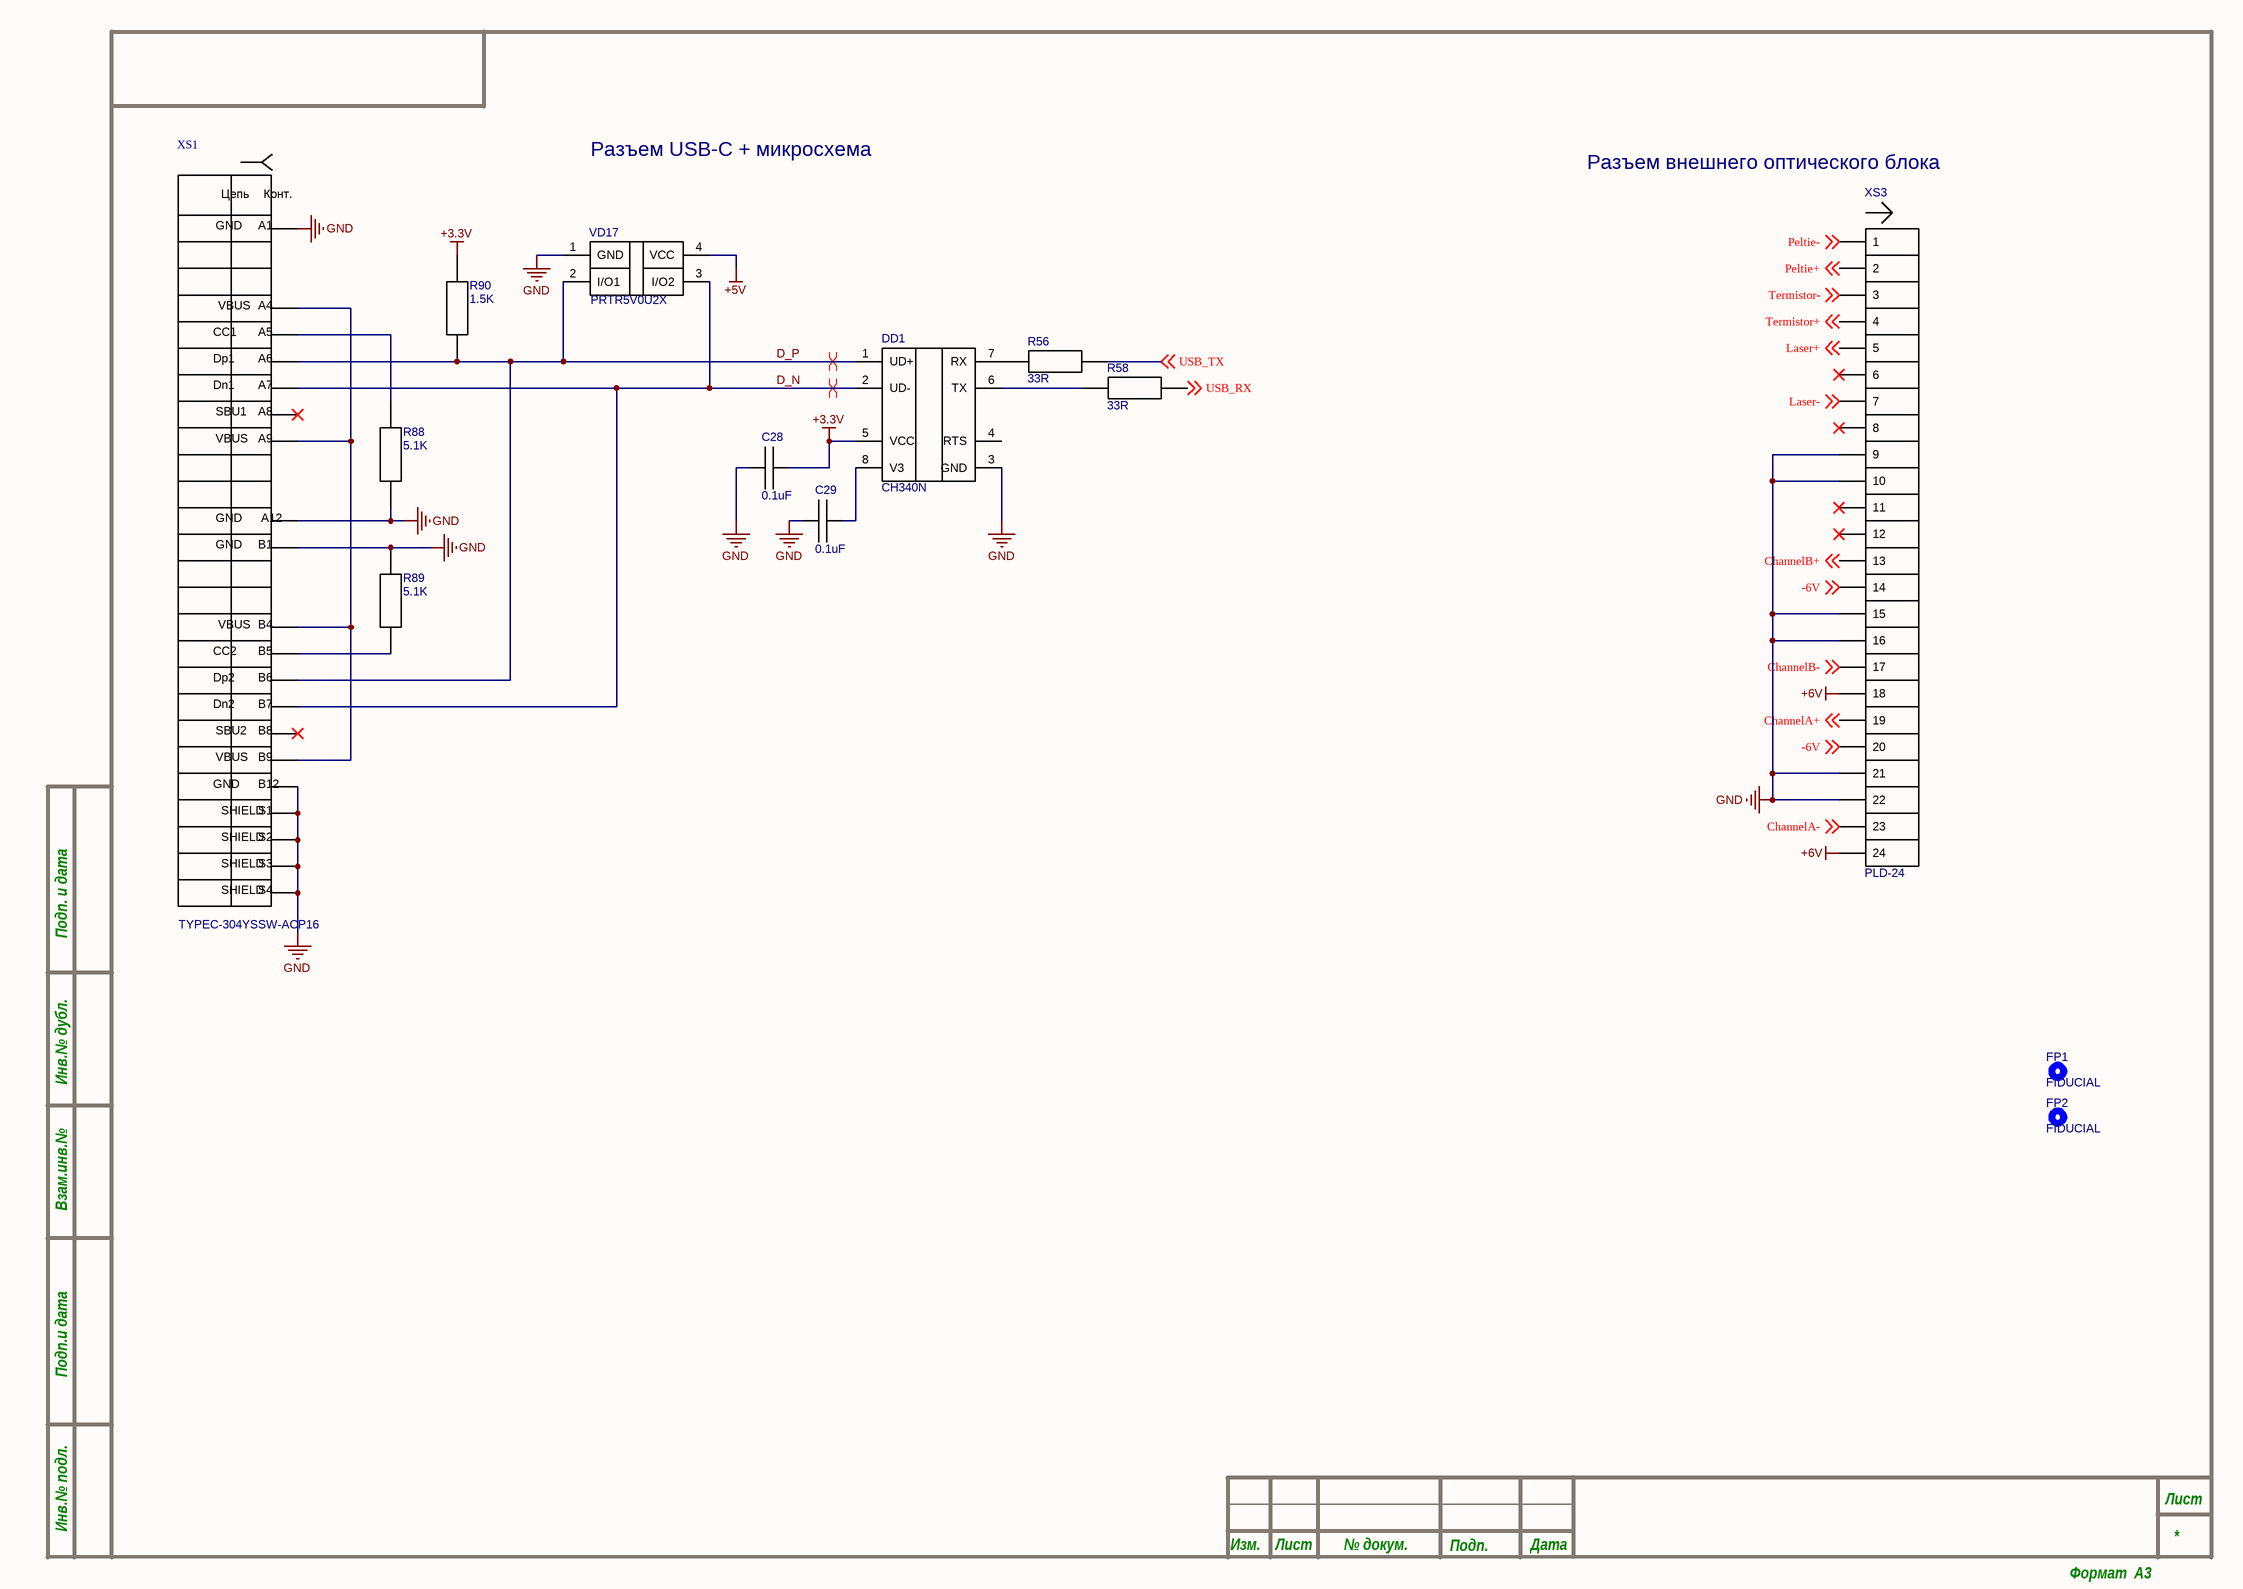
[diagram p4: Connectors.SchDoc]

### Parts
C28  0.1uF  [0603C]
C29  0.1uF  [0603C]
DD1  CH340N  [SOP8]
FP1  FIDUCIAL  [FIDICIAL POINT - R0.3]
FP2  FIDUCIAL  [FIDICIAL POINT - R0.3]
R56  33R  [R0402]
R58  33R  [R0402]
R88  5.1K  [R0402]
R89  5.1K  [R0402]
R90  1.5K  [R0402]
VD17  PRTR5V0U2X  [SOT143B]
XS1  TYPEC-304YSSW-ACP16  [USB-C 16P]
XS3  PLD-24  [PLD-24]

### Nets
+3.3V: C28.2 DD1.5(VCC) R90.2
+5V: VD17.4(VCC)
+6V: XS3.18 XS3.24
GND: C28.1 C29.1 DD1.3(GND) R88.1 R89.2 VD17.1(GND) XS1.A1/B12(GND) XS1.A12/B1(GND) XS1.S1(SHIELD) XS1.S2(SHIELD) XS1.S3(SHIELD) XS1.S4(SHIELD) XS3.9 XS3.10 XS3.15 XS3.16 XS3.21 XS3.22
-6V: XS3.14 XS3.20 ; off-sheet -6V
ChannelA+: XS3.19 ; off-sheet ChannelA+
ChannelA-: XS3.23 ; off-sheet ChannelA-
ChannelB+: XS3.13 ; off-sheet ChannelB+
ChannelB-: XS3.17 ; off-sheet ChannelB-
D_N: DD1.2(UD-) VD17.3(I/O2) XS1.A7(Dn1) XS1.B7(Dn2)
D_P: DD1.1(UD+) R90.1 VD17.2(I/O1) XS1.A6(Dp1) XS1.B6(Dp2)
Laser+: XS3.5 ; off-sheet Laser+
Laser-: XS3.7 ; off-sheet Laser-
Peltie+: XS3.2 ; off-sheet Peltie+
Peltie-: XS3.1 ; off-sheet Peltie-
Termistor+: XS3.4 ; off-sheet Termistor+
Termistor-: XS3.3 ; off-sheet Termistor-
USB_RX: R58.2 ; off-sheet USB_RX
USB_TX: R56.2 ; off-sheet USB_TX
NetC29_2: C29.2 DD1.8(V3)
NetDD1_6: DD1.6(TX) R58.1
NetDD1_7: DD1.7(RX) R56.1
NetR88_2: R88.2 XS1.A5(CC1)
NetR89_1: R89.1 XS1.B5(CC2)
NetXS1_A4/B9: XS1.A4/B9(VBUS) XS1.A9/B4(VBUS)

Not connected (* = marked no-connect by the designer): DD1 4(RTS); XS1 A8(SBU1)* B8(SBU2)*; XS3 6* 8* 11* 12*

### Layout directives
differential pair: D_N, D_P

### Notes on the sheet
- Разъем USB-C + микросхема
- Разъем внешнего оптического блока
- Подп. и дата
- Инв.№ дубл.
- Взам.инв.№
- Подп.и дата
- Инв.№ подл.
- Изм.
- Лист
- № докум.
- Подп.
- Дата
- Формат  A3
- (in symbol TYPEC-304YSSW-ACP16) Цепь; Конт.; A1; A4; A9; A12; B1; B4; B9; B12

### Library data of the parts
C28 C29 = C0603-0.1UF 10% 50V: as C5 on sheet Power; Created_at: 10/01/2023; MountType: SMD; Mount: MOUNT
DD1 = CH340N: USB to Serial Port Chip CH340, SOP-8; Added_by: irdolgopolowa@yandex.ru; Pkg: SOIC-8; Solder_Amount: 8; Created_at: 29/10/24; Mount: MOUNT; Part Number: CH340N; MountType: SMD
FP1 FP2 = FIDUCIAL_R0.3: Adder_by: ridel_av@teslatec.ru; Solder_Amount: -; Pkg: -; Created_at: 22/03/2020; Mount: -; MountType: -
R56 R58 = R0402-33R: Resistor SMD 33R 1% 0402; Part Number: SMD RES 33R OHM 1% ±100ppm/°C 0402; Added_by: Rutel@teslatec.ru; Solder_Amount: 2; Pkg: 0402; Created_at: 21/04/2020; MountType: SMD; Mount: MOUNT
R88 R89 = R0402-5.1K: Resistor SMD 5.1K 1% 0402; Part Number: SMD RES 5.1 KOHM 1% ±100ppm/°C 0402; Added_by: Rutel@teslatec.ru; Solder_Amount: 2; Pkg: 0402; Created_at: 21/04/2020; MountType: SMD; Mount: MOUNT
R90 = R0402-1.5K: Resistor SMD 1.5K 1% 0402; Part Number: SMD RES 1.5 KOHM 1% ±100ppm/°C 0402; Added_by: Rutel@teslatec.ru; Solder_Amount: 2; Pkg: 0402; Created_at: 21/04/2020; MountType: SMD; Mount: MOUNT
VD17 = PRTR5V0U2X: PRTR5V0U2X, ESD(Rail-to-Rail), 1pF,  5V; Added_by: irdolgopolowa@yandex.ru; Pkg: SOT-143; Solder_Amount: 4; Created_at: 29/10/24; Mount: MOUNT; MountType: SMD; Part Number: PRTR5V0U2X
XS1 = TYPEC-304YSSW-ACP16: USB Type-C, 16 Pin; Solder_Amount: 16; Added_by: ridel_av@teslatec.ru; MountType: SMD; Mount: MOUNT; Pkg: TYPEC-304YSSW-ACP16; Part Number: TYPEC-304YSSW-ACP16; Created_at: 13/12/2021
XS3 = PLD-24: Pin Header Pitch 2.54mm; Pkg: PLD-24 2.54mm; Solder_Amount: 24; Added_by: andrew@teslatec.ru; MountType: THM; Mount: MOUNT; Part Number: PLD-24; Mating Part: -; Mating Terminals: -; Cable/Wire: -; Created_at: 1/09/2020

## Sheet Check_Laser.SchDoc
size 420 x 297 mm
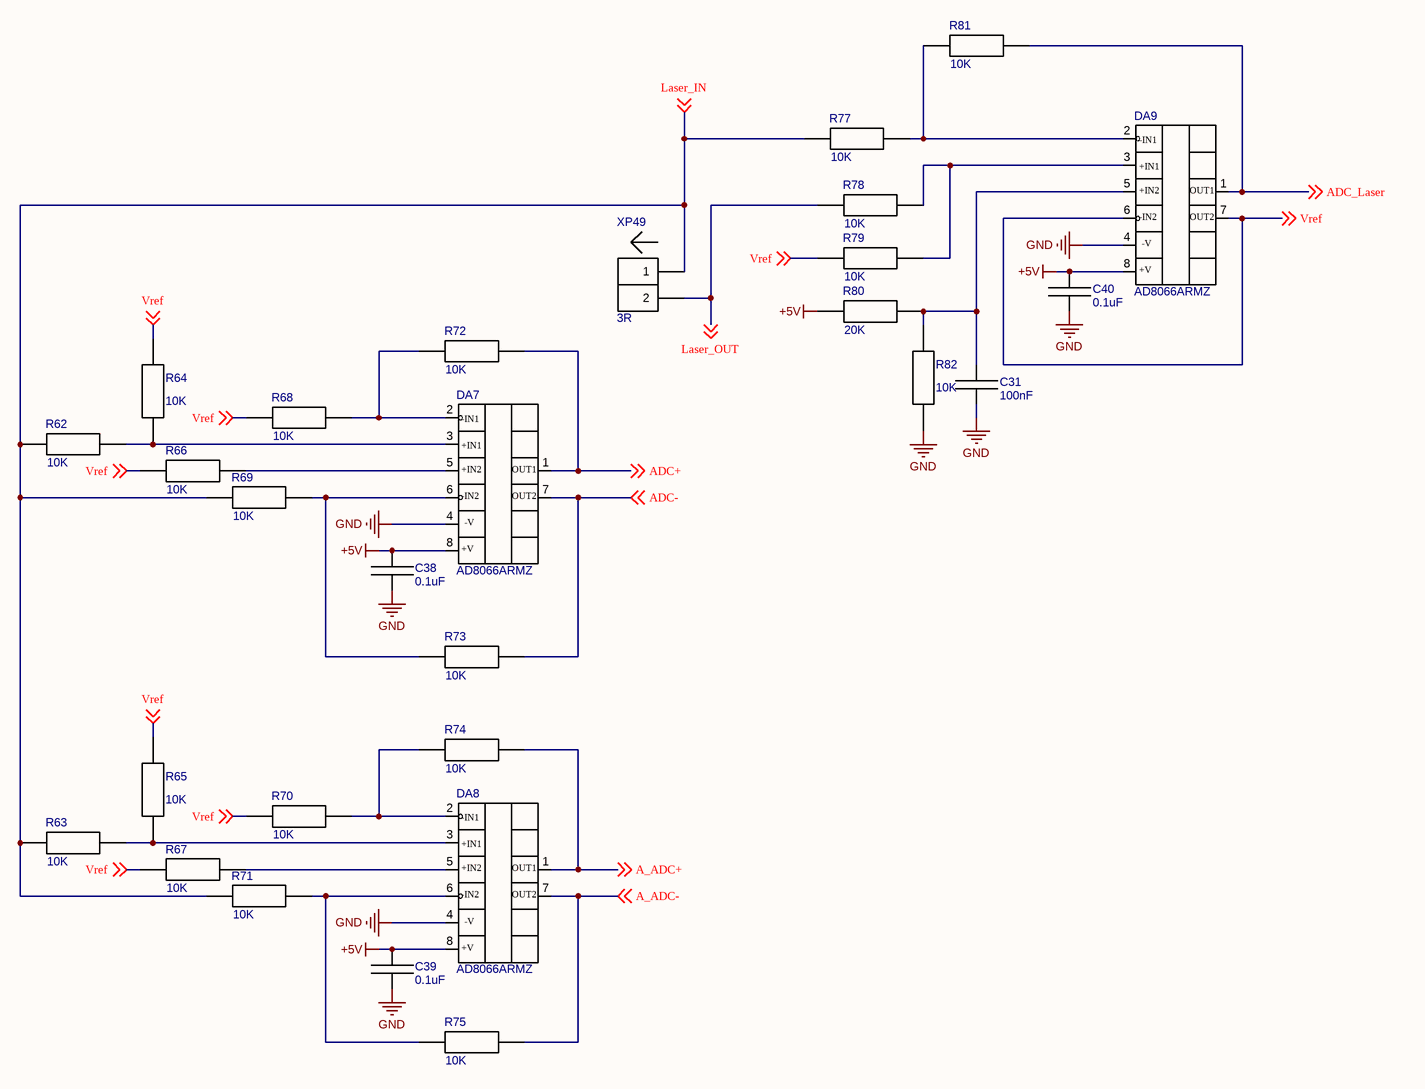
[diagram p5: Check_Laser.SchDoc]

### Parts
C31  100nF  [0402C]
C38  0.1uF  [0603C]
C39  0.1uF  [0603C]
C40  0.1uF  [0603C]
DA7  AD8066ARMZ  [MSOP-8]
DA8  AD8066ARMZ  [MSOP-8]
DA9  AD8066ARMZ  [MSOP-8]
R62  10K  [R0402]
R63  10K  [R0402]
R64  10K  [R0402]
R65  10K  [R0402]
R66  10K  [R0402]
R67  10K  [R0402]
R68  10K  [R0402]
R69  10K  [R0402]
R70  10K  [R0402]
R71  10K  [R0402]
R72  10K  [R0402]
R73  10K  [R0402]
R74  10K  [R0402]
R75  10K  [R0402]
R77  10K  [R0402]
R78  10K  [R0402]
R79  10K  [R0402]
R80  20K  [R0402]
R81  10K  [R0402]
R82  10K  [R0402]
XP49  3R  [PLS-2]

### Nets
+5V: C38.1 C39.1 C40.1 DA7.8(+VS) DA8.8(+VS) DA9.8(+VS) R80.1
GND: C31.1 C38.2 C39.2 C40.2 DA7.4(-VS) DA8.4(-VS) DA9.4(-VS) R82.1
A_ADC+: DA8.1(VOUT) R74.2 ; off-sheet A_ADC+
A_ADC-: DA8.7(VOUT2) R75.2 ; off-sheet A_ADC-
ADC+: DA7.1(VOUT) R72.2 ; off-sheet ADC+
ADC-: DA7.7(VOUT2) R73.2 ; off-sheet ADC-
ADC_Laser: DA9.1(VOUT) R81.2 ; off-sheet ADC_Laser
Laser_IN: R62.1 R63.1 R69.1 R71.1 R77.1 XP49.1 ; off-sheet Laser_IN
Laser_OUT: R78.1 XP49.2 ; off-sheet Laser_OUT
Vref: DA9.6(-IN2) DA9.7(VOUT2) R64.2 R65.2 R66.2 R67.2 R68.2 R70.2 R79.2 ; off-sheet Vref
NetC31_2: C31.2 DA9.5(+IN2) R80.2 R82.2
NetDA7_2: DA7.2(-IN1) R68.1 R72.1
NetDA7_3: DA7.3(+IN1) R62.2 R64.1
NetDA7_5: DA7.5(+IN2) R66.1
NetDA7_6: DA7.6(-IN2) R69.2 R73.1
NetDA8_2: DA8.2(-IN1) R70.1 R74.1
NetDA8_3: DA8.3(+IN1) R63.2 R65.1
NetDA8_5: DA8.5(+IN2) R67.1
NetDA8_6: DA8.6(-IN2) R71.2 R75.1
NetDA9_2: DA9.2(-IN1) R77.2 R81.1
NetDA9_3: DA9.3(+IN1) R78.2 R79.1

### Notes on the sheet
- Подп. и дата
- Инв.№ дубл.
- Взам.инв.№
- Подп.и дата
- Инв.№ подл.
- Изм.
- Лист
- № докум.
- Подп.
- Дата
- Формат  A3
- (in symbol AD8066ARMZ) OUT1; OUT2; -V; +V

### Library data of the parts
C31 = C0402-100nF 10% 50V: as C8 on sheet Power; Created_at: 27/03/2020; MountType: SMD; Mount: MOUNT
C38-C40 = C0603-0.1UF 10% 50V: as C5 on sheet Power; Created_at: 10/01/2023; MountType: SMD; Mount: MOUNT
DA7-DA9 = AD8066ARMZ: as DA5 on sheet ControlPoint; Created_at: 29/10/24; Mount: MOUNT; MountType: SMD; Pkg: MSOP-8; Part Number: AD8066ARMZ
R62-R75 R77-R79 R81 R82 = R0402-10K: as R6 on sheet Power; Created_at: 21/04/2020; MountType: SMD; Mount: MOUNT
R80 = R0402-20K: as R7 on sheet Power; Created_at: 21/04/2020; MountType: SMD; Mount: MOUNT
XP49 = PLS-2_Laser: KNP300JB-52-3R; Added_by: irdolgopolowa@yandex.ru; Solder_Amount: 2; Created_at: 29/10/24; Mount: MOUNT; MountType: THM; Part Number: PLS-2; Pkg: PLS-2; Mating Part: KNP300JB-52-3R

## Sheet Peltie.SchDoc
size 420 x 297 mm
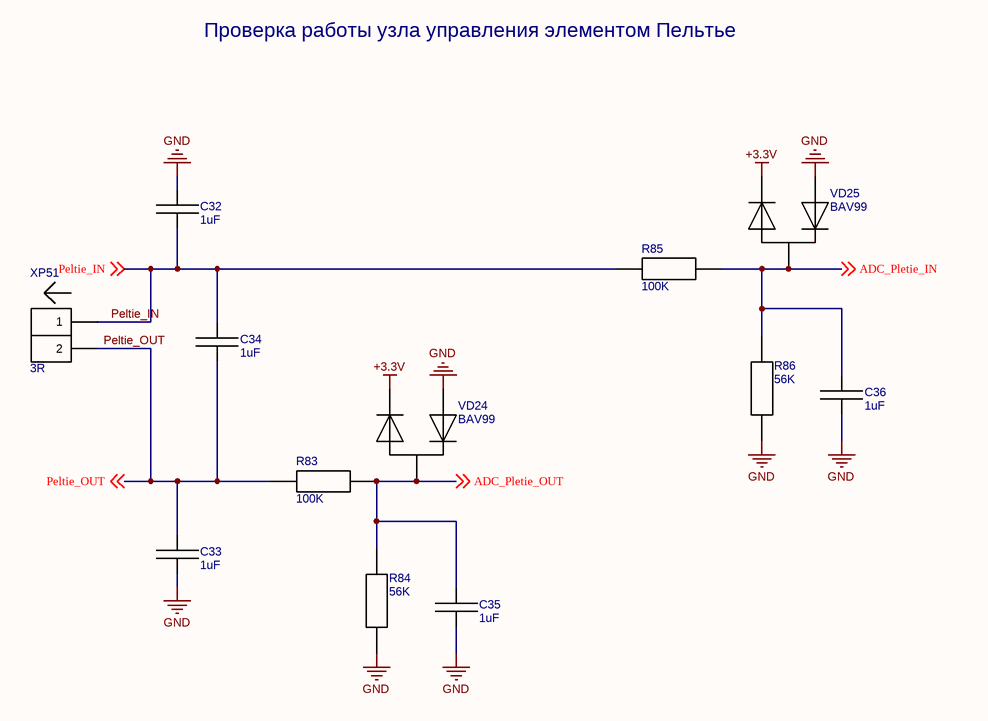
[diagram p6: Peltie.SchDoc]

### Parts
C32  1uF  [0603C]
C33  1uF  [0603C]
C34  1uF  [0603C]
C35  1uF  [0603C]
C36  1uF  [0603C]
R83  100K  [R0402]
R84  56K  [R0402]
R85  100K  [R0402]
R86  56K  [R0402]
VD24  BAV99  [SOT-23-3]
VD25  BAV99  [SOT-23-3]
XP51  3R  [PLS-2]

### Nets
+3.3V: VD24.2 VD25.2
GND: C32.2 C33.2 C35.1 C36.1 R84.2 R86.2 VD24.1 VD25.1
ADC_Pletie_IN: C36.2 R85.1 R86.1 VD25.3 ; off-sheet ADC_Pletie_IN
ADC_Pletie_OUT: C35.2 R83.1 R84.1 VD24.3 ; off-sheet ADC_Pletie_OUT
Peltie_IN: C32.1 C34.2 R85.2 XP51.1 ; off-sheet Peltie_IN
Peltie_OUT: C33.1 C34.1 R83.2 XP51.2 ; off-sheet Peltie_OUT

### Notes on the sheet
- Проверка работы узла управления элементом Пельтье
- Подп. и дата
- Инв.№ дубл.
- Взам.инв.№
- Подп.и дата
- Инв.№ подл.
- Изм.
- Лист
- № докум.
- Подп.
- Дата
- Формат  A3

### Library data of the parts
C32-C36 = C0603-1uF 10% 50V: as C10 on sheet Power; Created_at: 22/06/2021; MountType: SMD; Mount: MOUNT
R83 R85 = R0402-100K: as R5 on sheet Power; Created_at: 21/04/2020; MountType: SMD; Mount: MOUNT
R84 R86 = R0402-56K: as R11 on sheet ControlPoint; Created_at: 15/12/2021; MountType: SMD; Mount: MOUNT
VD24 VD25 = BAV99: as VD1 on sheet Power; Created_at: 29/06/2020; Mount: MOUNT; MountType: SMD; Pkg: SOT-23-3; Part Number: BAV99
XP51 = PLS-2_peltie: SQP10AJB-3R; Added_by: irdolgopolowa@yandex.ru; Solder_Amount: 2; Created_at: 29/10/24; Mount: MOUNT; MountType: THM; Part Number: PLS-2; Pkg: PLS-2; Mating Part: SQP10AJB-3R

## Sheet MUX.SchDoc
size 420 x 297 mm
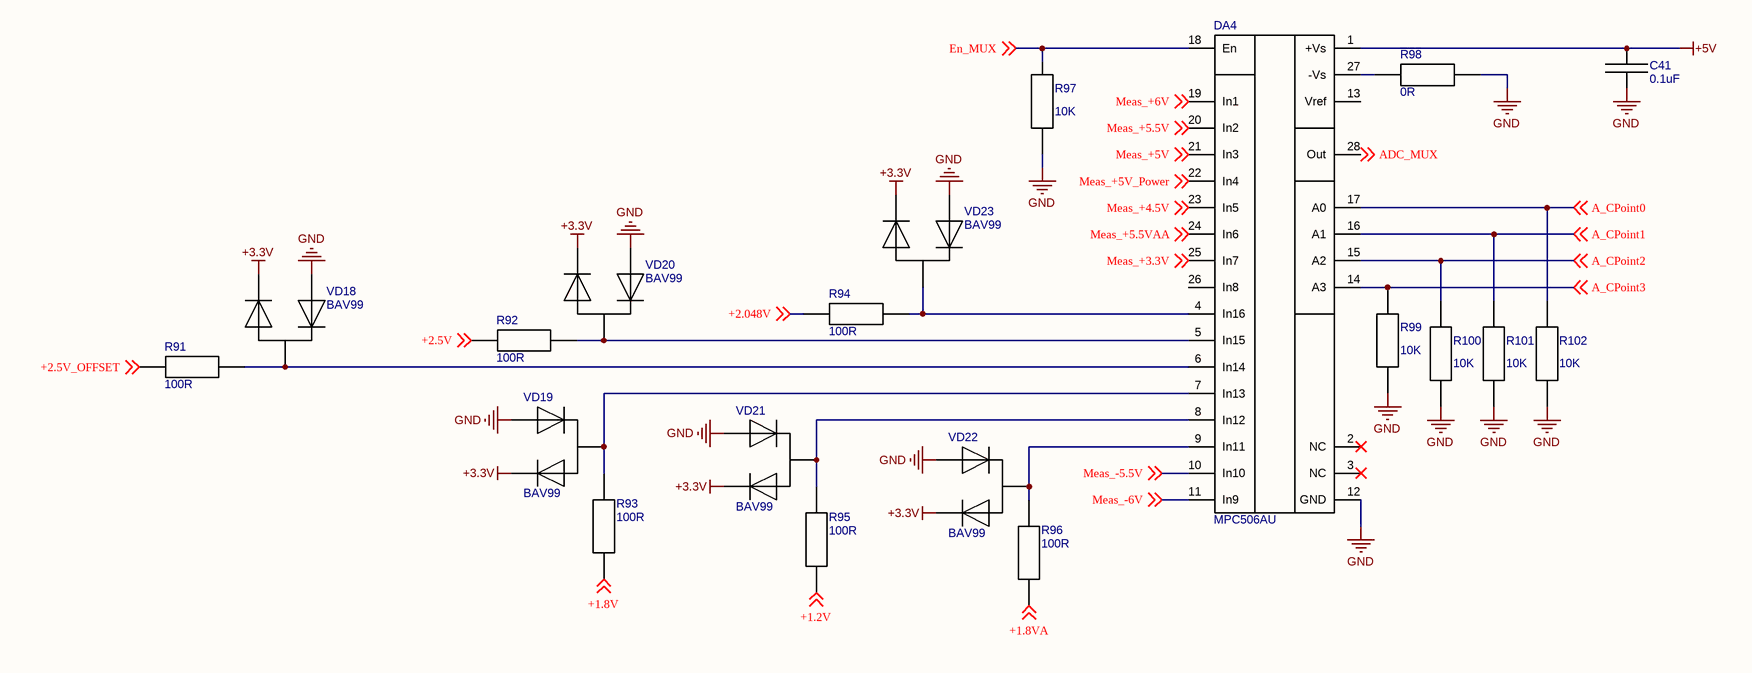
[diagram p7: MUX.SchDoc]

### Parts
C41  0.1uF  [0603C]
DA4  MPC506AU  [SOIC-28]
R91  100R  [R0402]
R92  100R  [R0402]
R93  100R  [R0402]
R94  100R  [R0402]
R95  100R  [R0402]
R96  100R  [R0402]
R97  10K  [R0402]
R98  0R  [R0402]
R99  10K  [R0402]
R100  10K  [R0402]
R101  10K  [R0402]
R102  10K  [R0402]
VD18  BAV99  [SOT-23-3]
VD19  BAV99  [SOT-23-3]
VD20  BAV99  [SOT-23-3]
VD21  BAV99  [SOT-23-3]
VD22  BAV99  [SOT-23-3]
VD23  BAV99  [SOT-23-3]

### Nets
+3.3V: VD18.2 VD19.2 VD20.2 VD21.2 VD22.2 VD23.2
+5V: C41.1 DA4.1(+Vs)
GND: C41.2 DA4.12(GND) R97.2 R98.1 R99.1 R100.1 R101.1 R102.1 VD18.1 VD19.1 VD20.1 VD21.1 VD22.1 VD23.1
+1.2V: R95.1 ; off-sheet +1.2V
+1.8V: R93.1 ; off-sheet +1.8V
+1.8VA: R96.1 ; off-sheet +1.8VA
+2.5V: R92.1 ; off-sheet +2.5V
+2.5V_OFFSET: R91.1 ; off-sheet +2.5V_OFFSET
+2.048V: R94.1 ; off-sheet +2.048V
A_CPoint0: DA4.17(A0) R102.2 ; off-sheet A_CPoint0
A_CPoint1: DA4.16(A1) R101.2 ; off-sheet A_CPoint1
A_CPoint2: DA4.15(A2) R100.2 ; off-sheet A_CPoint2
A_CPoint3: DA4.14(A3) R99.2 ; off-sheet A_CPoint3
ADC_MUX: DA4.28(Out) ; off-sheet ADC_MUX
En_MUX: DA4.18(En) R97.1 ; off-sheet En_MUX
Meas_+3.3V: DA4.25(In7) ; off-sheet Meas_+3.3V
Meas_+4.5V: DA4.23(In5) ; off-sheet Meas_+4.5V
Meas_+5.5V: DA4.20(In2) ; off-sheet Meas_+5.5V
Meas_+5.5VAA: DA4.24(In6) ; off-sheet Meas_+5.5VAA
Meas_+5V: DA4.21(In3) ; off-sheet Meas_+5V
Meas_+5V_Power: DA4.22(In4) ; off-sheet Meas_+5V_Power
Meas_+6V: DA4.19(In1) ; off-sheet Meas_+6V
Meas_-5.5V: DA4.10(In10) ; off-sheet Meas_-5.5V
Meas_-6V: DA4.11(In9) ; off-sheet Meas_-6V
NetDA4_4: DA4.4(In16) R94.2 VD23.3
NetDA4_5: DA4.5(In15) R92.2 VD20.3
NetDA4_6: DA4.6(In14) R91.2 VD18.3
NetDA4_7: DA4.7(In13) R93.2 VD19.3
NetDA4_8: DA4.8(In12) R95.2 VD21.3
NetDA4_9: DA4.9(In11) R96.2 VD22.3
NetDA4_27: DA4.27(-Vs) R98.2

Not connected (* = marked no-connect by the designer): DA4 2(NC)* 3(NC)* 13(Vref) 26(In8)

### Notes on the sheet
- Подп. и дата
- Инв.№ дубл.
- Взам.инв.№
- Подп.и дата
- Инв.№ подл.
- Изм.
- Лист
- № докум.
- Подп.
- Дата
- Формат  A3

### Library data of the parts
C41 = C0603-0.1UF 10% 50V: as C5 on sheet Power; Created_at: 10/01/2023; MountType: SMD; Mount: MOUNT
DA4 = MPC506AU: MPC506AU, Ch: 16, SO28; Added_by: irdolgopolowa@yandex.ru; Solder_Amount: 28; Mount: MOUNT; MountType: SMD/SMT; Part Number: MPC506A; Created_at: 29/10/2024; Pkg: SOIC-28
R91-R96 = R0402-100R: as R14 on sheet Power; Created_at: 29/10/24; MountType: SMD; Mount: MOUNT
R97 R99-R102 = R0402-10K: as R6 on sheet Power; Created_at: 21/04/2020; MountType: SMD; Mount: MOUNT
R98 = R0402-0R: as R41 on sheet STM; Created_at: 29/10/24; MountType: SMD; Mount: MOUNT
VD18-VD23 = BAV99: as VD1 on sheet Power; Created_at: 29/06/2020; Mount: MOUNT; MountType: SMD; Pkg: SOT-23-3; Part Number: BAV99

## Nets that join several sheets
+3.3V: ControlPoint (7 pins), STM (6 pins), Connectors (C28.2 DD1.5 R90.2), Peltie (VD24.2 VD25.2), MUX (6 pins)
+5V: Power (C5.2 C11.2 DA2.3 DA3.1), ControlPoint (C17.1 DA5.8 R31.2 VD16.2), STM (XP2.1 XP2.38), Connectors (VD17.4), Check_Laser (7 pins), MUX (C41.1 DA4.1)
+6V: Power (12 pins), Rele (12 pins), Connectors (XS3.18 XS3.24)
GND: Power (25 pins), ControlPoint (34 pins), Rele (18 pins), STM (5 pins), Connectors (18 pins), Check_Laser (8 pins), Peltie (8 pins), MUX (14 pins)
+1.2V: ControlPoint (XS4.13), MUX (R95.1)
+1.8V: ControlPoint (XS4.12), MUX (R93.1)
+1.8VA: ControlPoint (XS4.14), MUX (R96.1)
+2.5V: ControlPoint (XS4.10), MUX (R92.1)
+2.5V_OFFSET: ControlPoint (XS4.11), MUX (R91.1)
+2.048V: ControlPoint (XS4.9), MUX (R94.1)
-6V: ControlPoint (R15.1 XP1.3), Connectors (XS3.14 XS3.20)
A_ADC+: Rele (К3.7), Check_Laser (DA8.1 R74.2)
A_ADC-: Rele (К3.2), Check_Laser (DA8.7 R75.2)
A_CPoint0: STM (XP2.33), MUX (DA4.17 R102.2)
A_CPoint1: STM (XP2.34), MUX (DA4.16 R101.2)
A_CPoint2: STM (XP2.35), MUX (DA4.15 R100.2)
A_CPoint3: STM (XP2.36), MUX (DA4.14 R99.2)
ADC+: Rele (К5.7), Check_Laser (DA7.1 R72.2)
ADC-: Rele (К5.2), Check_Laser (DA7.7 R73.2)
ADC_ACM_IN: ControlPoint (XS5.22), Rele (К3.6)
ADC_ACM_OUT: ControlPoint (XS5.21), Rele (К3.3)
ADC_Ipower: Power (DA2.6), STM (XP2.10)
ADC_Laser: STM (XP2.15), Check_Laser (DA9.1 R81.2)
ADC_MUX: STM (XP2.14), MUX (DA4.28)
ADC_Pletie_IN: STM (XP2.8), Peltie (C36.2 R85.1 R86.1 VD25.3)
ADC_Pletie_OUT: STM (XP2.9), Peltie (C35.2 R83.1 R84.1 VD24.3)
ADC_REP_IN: ControlPoint (XS5.27), Rele (К5.6)
ADC_REP_OUT: ControlPoint (XS5.26), Rele (К5.3)
ADC_Upower: Power (R5.2 R7.1), STM (XP2.11)
ChannelA+: Rele (К3.5), Connectors (XS3.19)
ChannelA-: Rele (К3.4), Connectors (XS3.23)
ChannelB+: Rele (К5.5), Connectors (XS3.13)
ChannelB-: Rele (К5.4), Connectors (XS3.17)
En_MUX: STM (XP2.32), MUX (DA4.18 R97.1)
GPS_RX: ControlPoint (XS4.24), STM (R42.1 R103.1)
GPS_TX: ControlPoint (XS4.23), STM (R41.1 R59.1)
Ipower_ACM: Power (К1.3), ControlPoint (XP1.5)
Laser+: Rele (К7.5), Connectors (XS3.5)
Laser-: Rele (К7.4), Connectors (XS3.7)
Laser_ACM_IN: ControlPoint (XS5.12), Rele (К7.6)
Laser_ACM_OUT: ControlPoint (XS5.11), Rele (К7.3)
Laser_IN: Rele (К7.7), Check_Laser (6 pins)
Laser_OUT: Rele (К7.2), Check_Laser (R78.1 XP49.2)
Meas_+3.3V: ControlPoint (C20.2 R26.2 R27.1 VD13.3), MUX (DA4.25)
Meas_+4.5V: ControlPoint (C16.2 R18.2 R19.1 VD12.3), MUX (DA4.23)
Meas_+5.5V: ControlPoint (C15.2 R16.2 R17.1 VD11.3), MUX (DA4.20)
Meas_+5.5VAA: ControlPoint (C19.2 R24.2 R25.1 VD15.3), MUX (DA4.24)
Meas_+5V: ControlPoint (C13.2 R12.2 R13.1 VD10.3), MUX (DA4.21)
Meas_+5V_Power: ControlPoint (C18.2 R22.2 R23.1 VD14.3), MUX (DA4.22)
Meas_+6V: ControlPoint (C12.2 R10.2 R11.1 VD9.3), MUX (DA4.19)
Meas_-5.5V: ControlPoint (C22.2 DA5.1 R32.2), MUX (DA4.10)
Meas_-6V: ControlPoint (C37.2 DA5.7 R21.2), MUX (DA4.11)
Peltie+: Rele (К6.5), Connectors (XS3.2)
Peltie-: Rele (К6.4), Connectors (XS3.1)
Peltie_ACM_IN: ControlPoint (XS5.7), Rele (К6.6)
Peltie_ACM_OUT: ControlPoint (XS5.6), Rele (К6.3)
Peltie_IN: Rele (К6.7), Peltie (C32.1 C34.2 R85.2 XP51.1)
Peltie_OUT: Rele (К6.2), Peltie (C33.1 C34.1 R83.2 XP51.2)
R1_IN: ControlPoint (XS5.2), Rele (К2.6)
R1_OUT: ControlPoint (R26.1 XS4.6), Rele (К2.5)
R22_IN: ControlPoint (XS5.1), Rele (К2.3)
R22_OUT: ControlPoint (R22.1 XS4.3), Rele (К2.4)
RL1_Control: Power (R14.2), STM (XP2.18)
RL2_Control: Rele (R28.2), STM (XP2.37)
RL3+_Control: Rele (5 pins), STM (XP2.19)
RS232_RX: ControlPoint (XS4.21), STM (R51.1 R61.1)
RS232_TX: ControlPoint (XS4.22), STM (R50.1 R60.1)
Termistor+: Rele (К4.5), Connectors (XS3.4)
Termistor-: Rele (К4.4), Connectors (XS3.3)
TR_ACM_IN: ControlPoint (XS5.17), Rele (К4.6)
TR_ACM_OUT: ControlPoint (XS5.16), Rele (К4.3)
USB_RX: STM (XP2.12), Connectors (R58.2)
USB_TX: STM (XP2.13), Connectors (R56.2)